# EAGLE design BLDC (EAGLE 8.0.1)
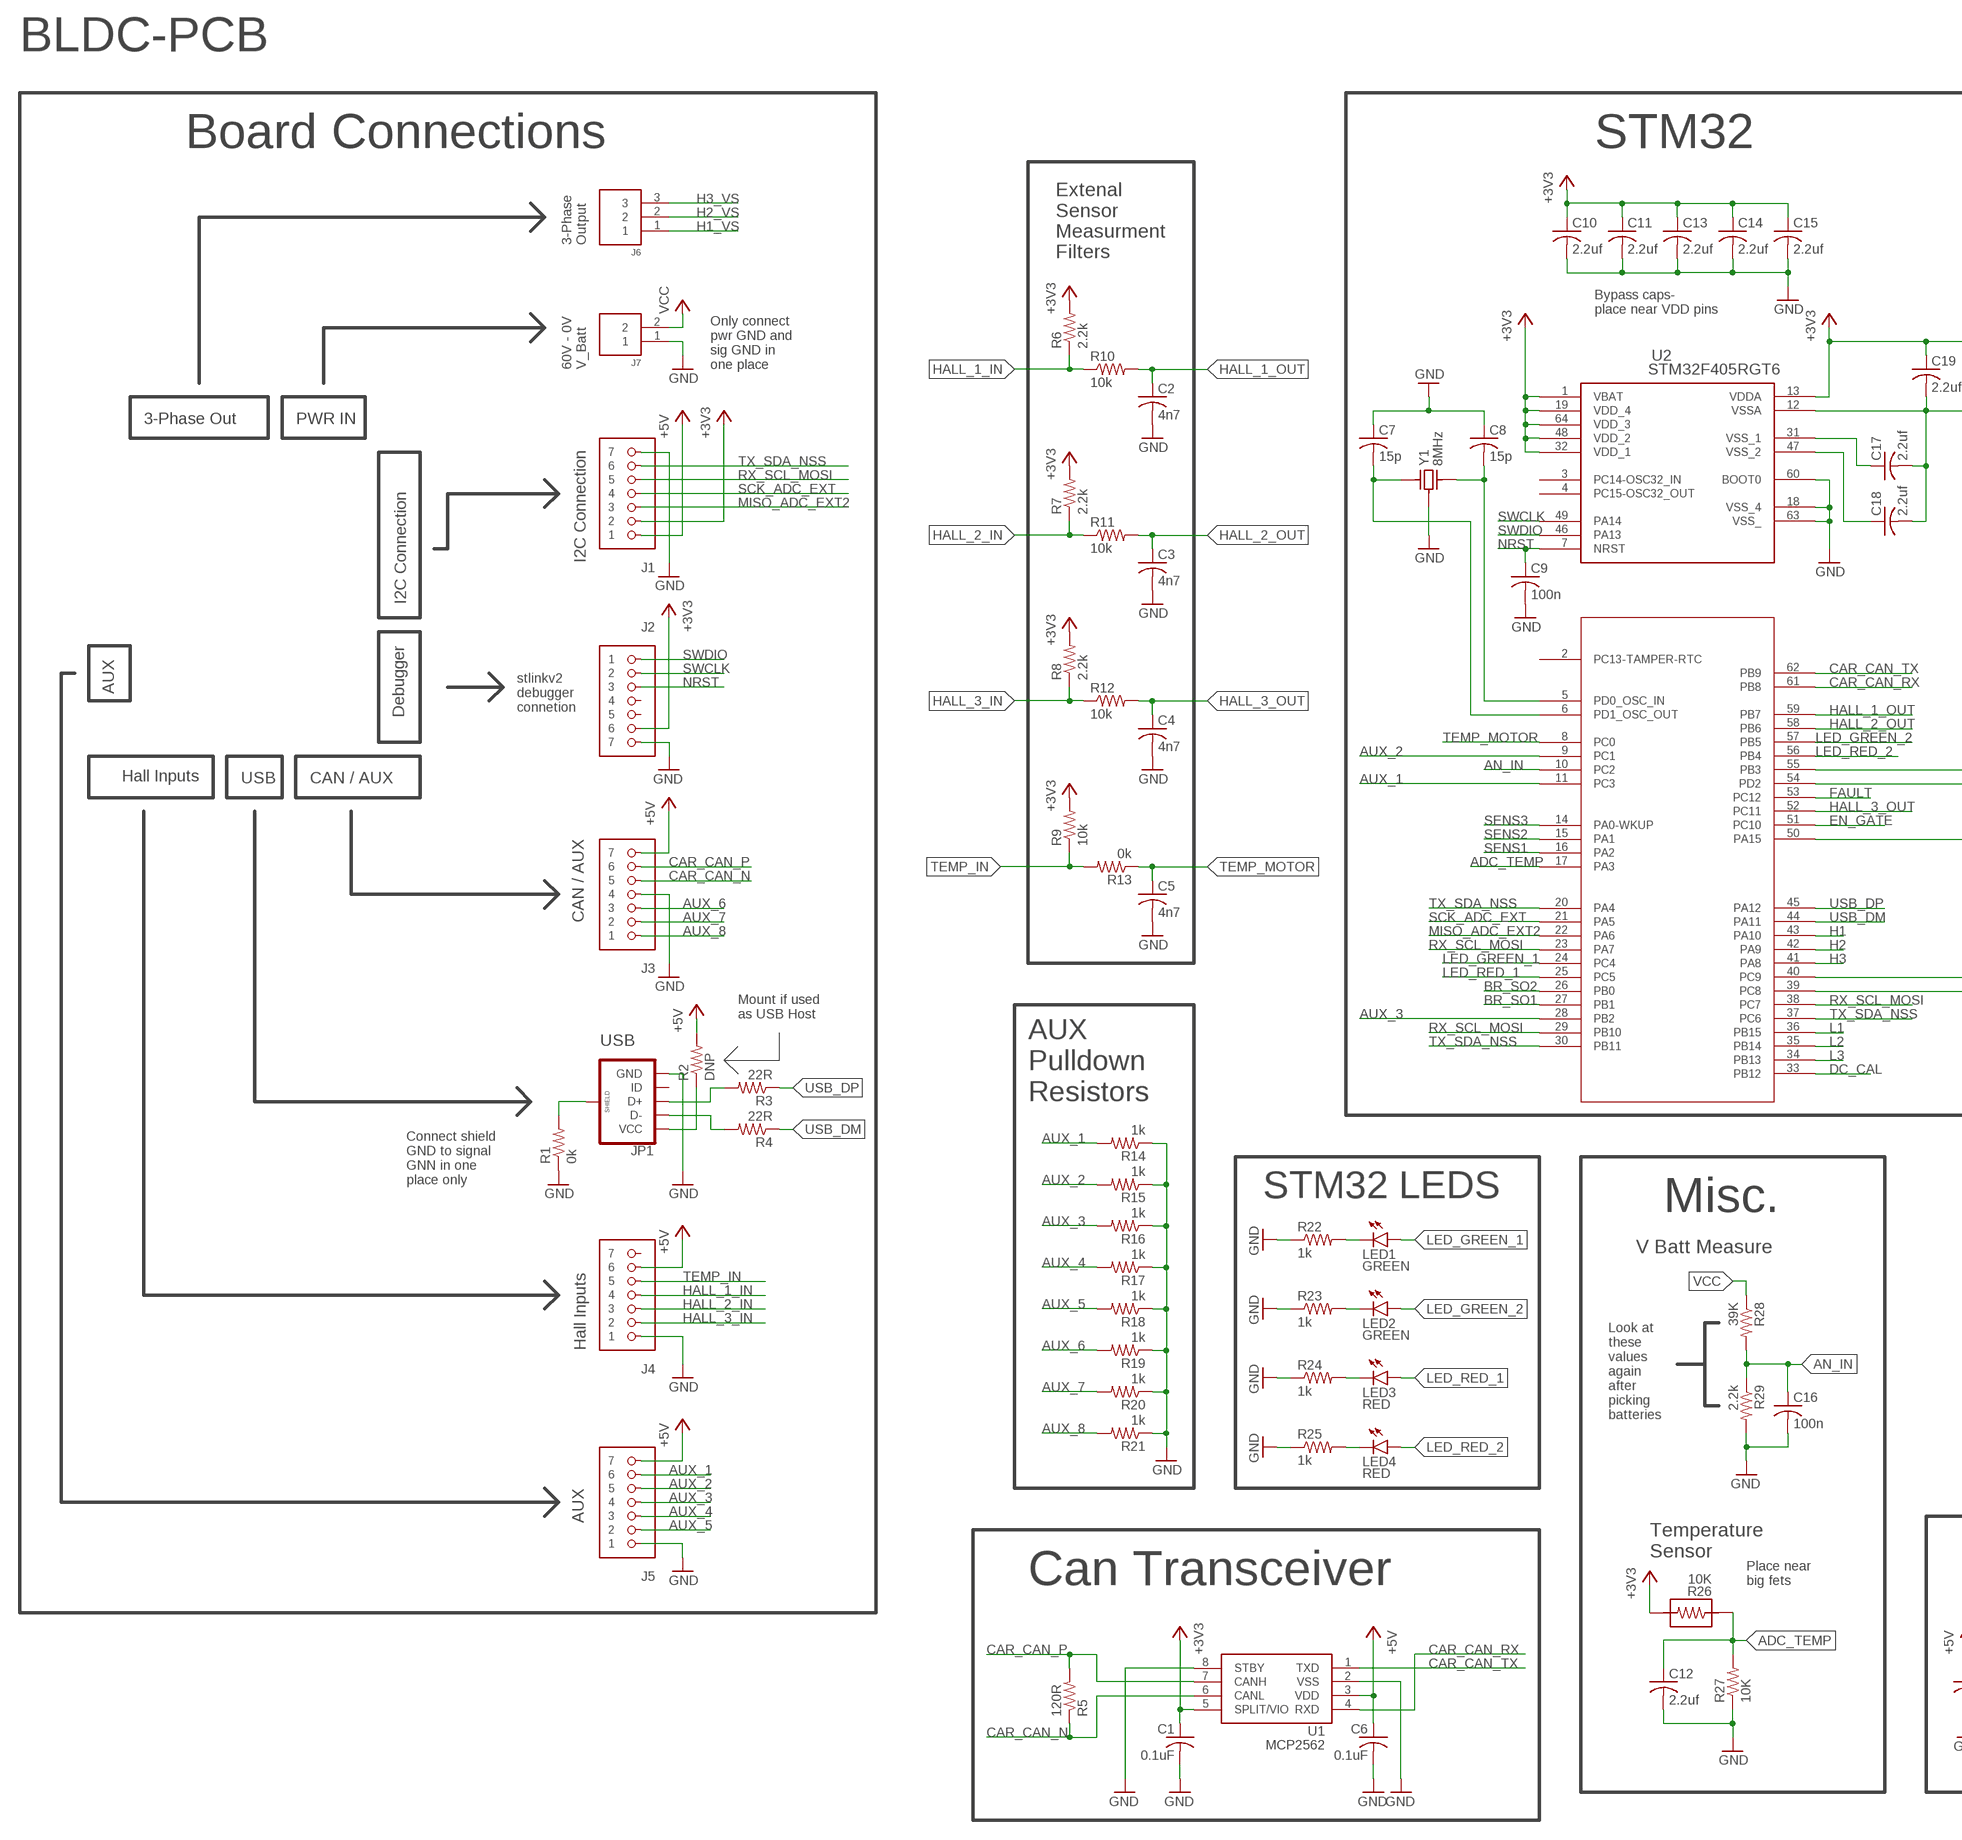
[diagram p0: schematic, sheet 1, part 1 of 2]
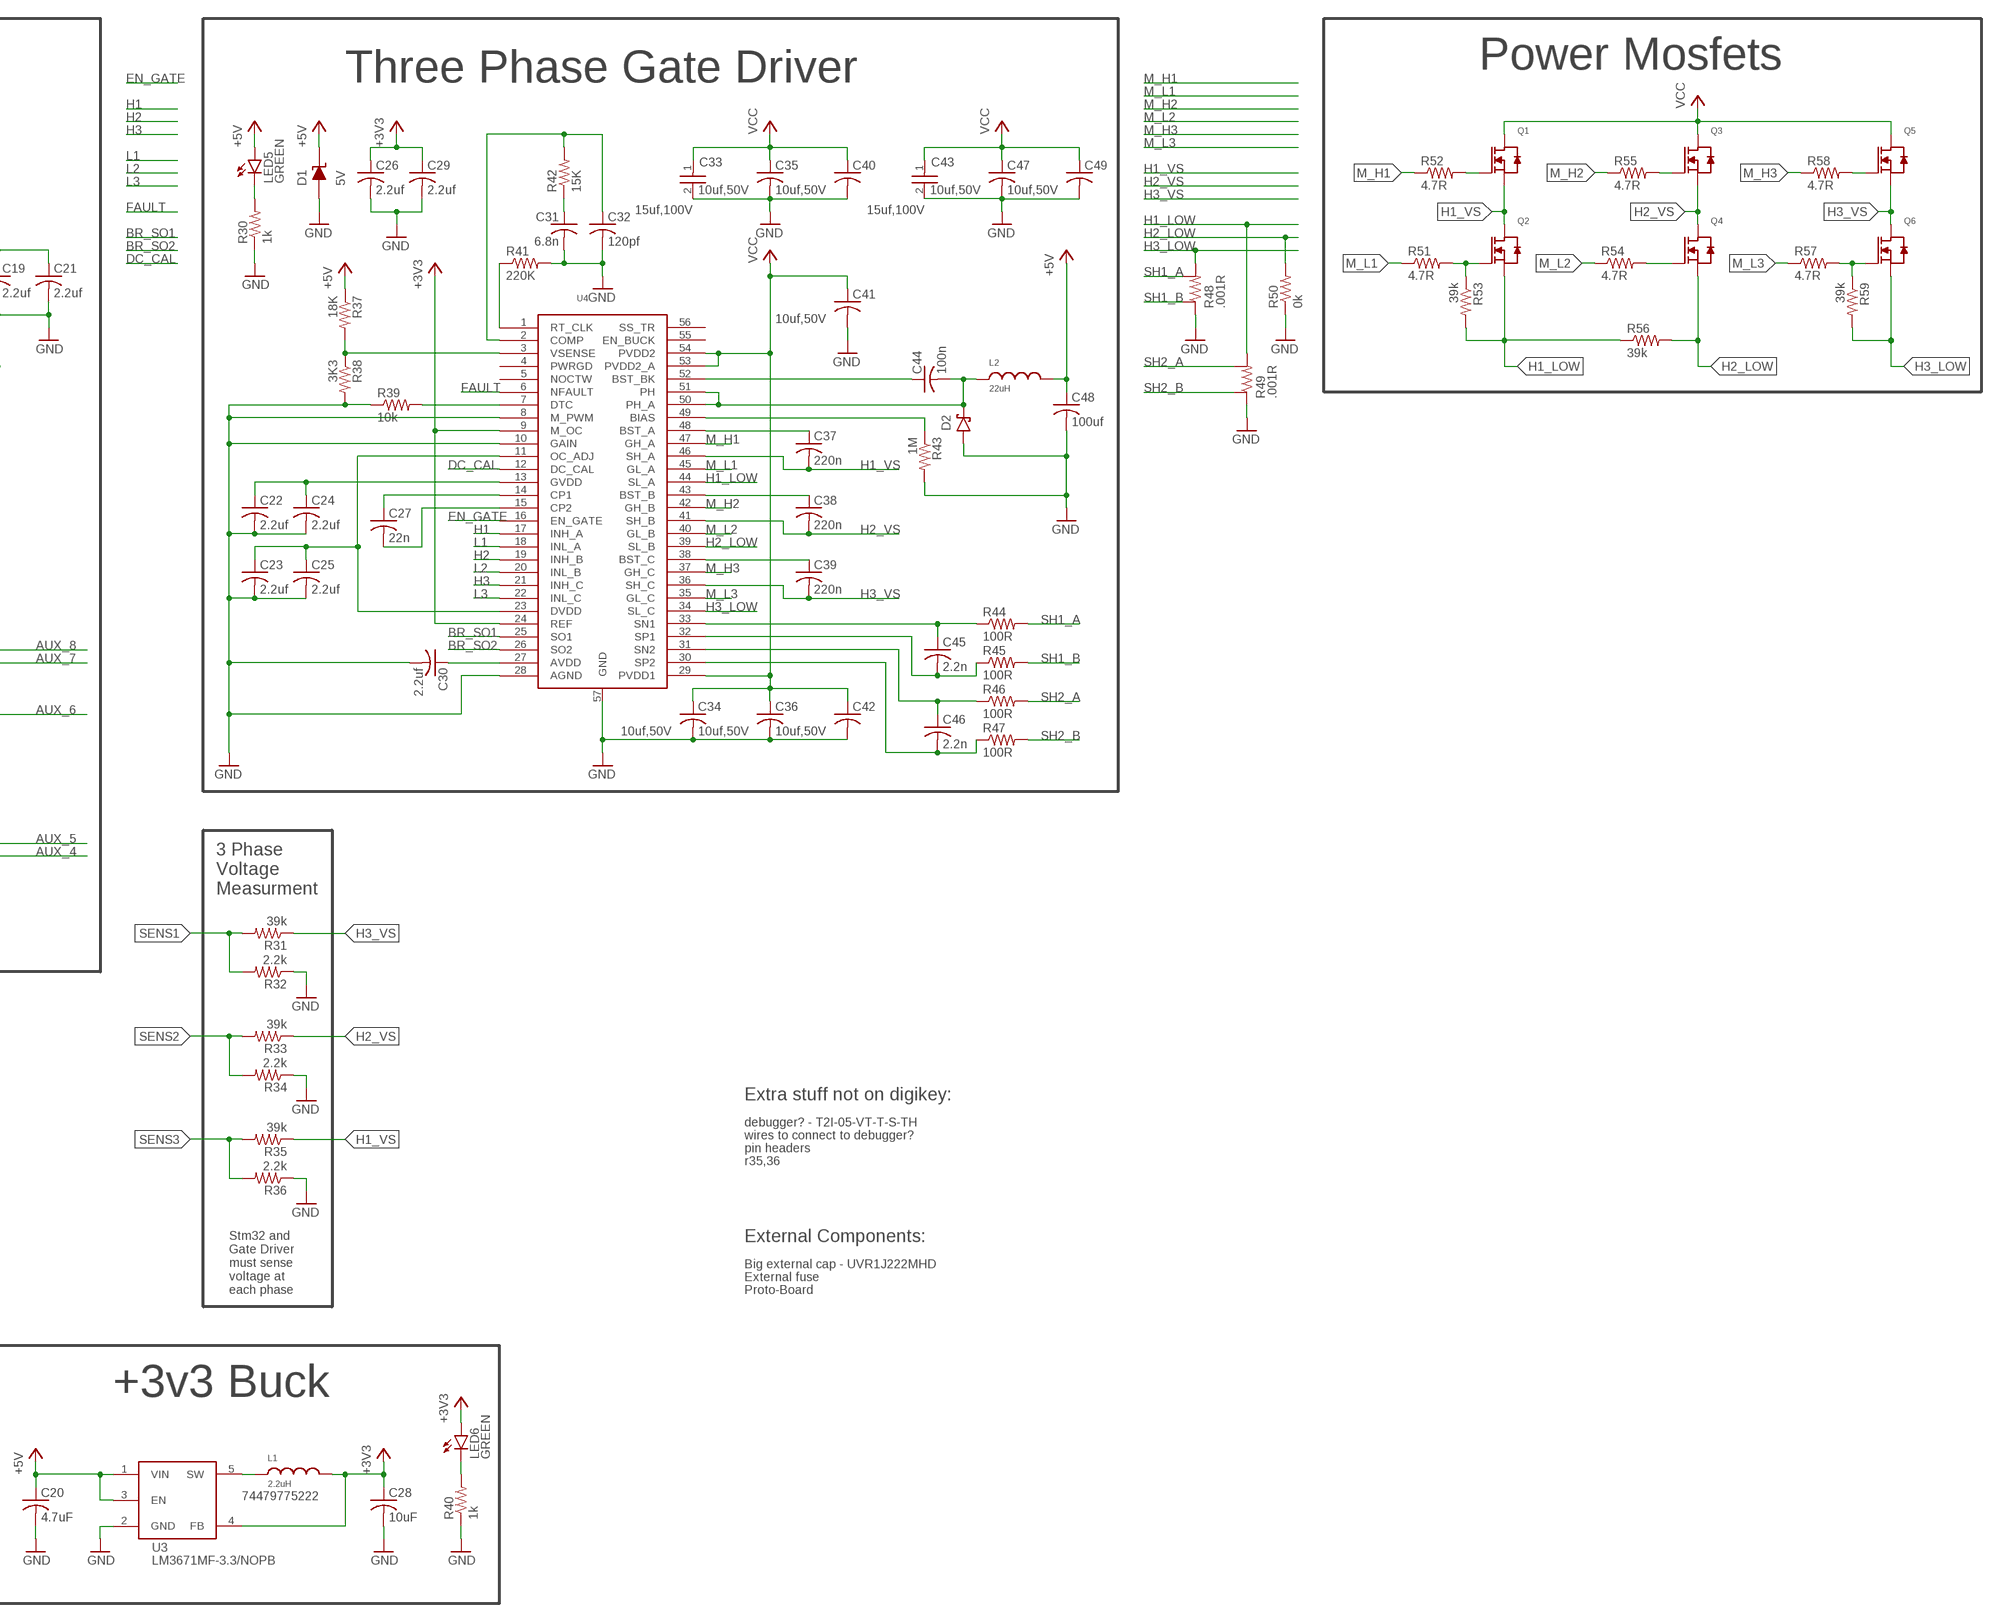
[diagram p1: schematic, sheet 1, part 2 of 2]

## Parts
C1  0.1uF  C-USC0805  [C0805]
C2  4n7  C-USC0805  [C0805]
C3  4n7  C-USC0805  [C0805]
C4  4n7  C-USC0805  [C0805]
C5  4n7  C-USC0805  [C0805]
C6  0.1uF  C-USC0805  [C0805]
C7  15p  C-USC0805  [C0805]
C8  15p  C-USC0805  [C0805]
C9  100n  C-USC0805  [C0805]
C10  2.2uf  C-USC0805  [C0805]
C11  2.2uf  C-USC0805  [C0805]
C12  2.2uf  C-USC0805  [C0805]
C13  2.2uf  C-USC0805  [C0805]
C14  2.2uf  C-USC0805  [C0805]
C15  2.2uf  C-USC0805  [C0805]
C16  100n  C-USC0805  [C0805]
C17  2.2uf  C-USC0805  [C0805]
C18  2.2uf  C-USC0805  [C0805]
C19  2.2uf  C-USC0805  [C0805]
C20  4.7uF  C-USC0805  [C0805]
C21  2.2uf  C-USC0805  [C0805]
C22  2.2uf  C-USC0805  [C0805]
C23  2.2uf  C-USC0805  [C0805]
C24  2.2uf  C-USC0805  [C0805]
C25  2.2uf  C-USC0805  [C0805]
C26  2.2uf  C-USC0805  [C0805]
C27  22n  C-USC0805  [C0805]
C28  10uF  C-USC0805  [C0805]
C29  2.2uf  C-USC0805  [C0805]
C30  2.2uf  C-USC0805  [C0805]
C31  6.8n  C-USC0805  [C0805]
C32  120pf  C-USC0805  [C0805]
C33  15uf,100V  KCM55WR72A156MH01K  [K-55]
C34  10uf,50V  C-USC1206  [C1206]
C35  10uf,50V  C-USC1206  [C1206]
C36  10uf,50V  C-USC1206  [C1206]
C37  220n  C-USC0805  [C0805]
C38  220n  C-USC0805  [C0805]
C39  220n  C-USC0805  [C0805]
C40  10uf,50V  C-USC1206  [C1206]
C41  10uf,50V  C-USC1206  [C1206]
C42  10uf,50V  C-USC1206  [C1206]
C43  15uf,100V  KCM55WR72A156MH01K  [K-55]
C44  100n  C-USC0805  [C0805]
C45  2.2n  C-USC0805  [C0805]
C46  2.2n  C-USC0805  [C0805]
C47  10uf,50V  C-USC1206  [C1206]
C48  100uf  C-USC0805  [C0805]
C49  10uf,50V  C-USC1206  [C1206]
D1  5V  PLVA650A  [SOT-23_DIODE]
D2  CD1206-B260  [1206-DIODE]
J1  JST-1X7-MICRO  [JST-1X7]
J2  JST-1X7-MICRO  [JST-1X7]
J3  JST-1X7-MICRO  [JST-1X7]
J4  JST-1X7-MICRO  [JST-1X7]
J5  JST-1X7-MICRO  [JST-1X7]
J6  IPBT-103-H1-XX-S-RA  [IPBT-103-H1-XX-S-RA]
J7  IPBT-102-H1-XX-S-RA  [IPBT-102-H1-XX-S-RA]
JP1  USB_MICROB_PLUG-PTH3  [MOLEX-MICROUSB-B-105017-0001]
L1  2.2uH  L0805  [0805]
L2  22uH  TYS5040220M-10  [TYS5040220M-10]
LED1  GREEN  LEDCHIP-LED0805  [CHIP-LED0805]
LED2  GREEN  LEDCHIP-LED0805  [CHIP-LED0805]
LED3  RED  5988110107F  [CHIP-LED0805]
LED4  RED  5988110107F  [CHIP-LED0805]
LED5  GREEN  LEDCHIP-LED0805  [CHIP-LED0805]
LED6  GREEN  LEDCHIP-LED0805  [CHIP-LED0805]
Q1  IRFS7530TRLPBF  [D2PAK]
Q2  IRFS7530TRLPBF  [D2PAK]
Q3  IRFS7530TRLPBF  [D2PAK]
Q4  IRFS7530TRLPBF  [D2PAK]
Q5  IRFS7530TRLPBF  [D2PAK]
Q6  IRFS7530TRLPBF  [D2PAK]
R1  0k  R-US_R0805  [R0805]
R2  DNP  R-US_R0805  [R0805]
R3  22R  R-US_R0805  [R0805]
R4  22R  R-US_R0805  [R0805]
R5  120R  R-US_R0805  [R0805]
R6  2.2k  R-US_R0805  [R0805]
R7  2.2k  R-US_R0805  [R0805]
R8  2.2k  R-US_R0805  [R0805]
R9  10k  R-US_R0805  [R0805]
R10  10k  R-US_R0805  [R0805]
R11  10k  R-US_R0805  [R0805]
R12  10k  R-US_R0805  [R0805]
R13  0k  R-US_R0805  [R0805]
R14  1k  R-US_R0805  [R0805]
R15  1k  R-US_R0805  [R0805]
R16  1k  R-US_R0805  [R0805]
R17  1k  R-US_R0805  [R0805]
R18  1k  R-US_R0805  [R0805]
R19  1k  R-US_R0805  [R0805]
R20  1k  R-US_R0805  [R0805]
R21  1k  R-US_R0805  [R0805]
R22  1k  R-US_R0805  [R0805]
R23  1k  R-US_R0805  [R0805]
R24  1k  R-US_R0805  [R0805]
R25  1k  R-US_R0805  [R0805]
R26  10K  NCP18XH103F03RB  [0603]
R27  10K  R-US_R0805  [R0805]
R28  39K  R-US_R0805  [R0805]
R29  2.2k  R-US_R0805  [R0805]
R30  1k  R-US_R0805  [R0805]
R31  39k  R-US_R0805  [R0805]
R32  2.2k  R-US_R0805  [R0805]
R33  39k  R-US_R0805  [R0805]
R34  2.2k  R-US_R0805  [R0805]
R35  39k  R-US_R0805  [R0805]
R36  2.2k  R-US_R0805  [R0805]
R37  18K  R-US_R0805  [R0805]
R38  3K3  R-US_R0805  [R0805]
R39  10k  R-US_R0805  [R0805]
R40  1k  R-US_R0805  [R0805]
R41  220K  R-US_R0805  [R0805]
R42  15K  R-US_R0805  [R0805]
R43  1M  R-US_R0805  [R0805]
R44  100R  R-US_R0805  [R0805]
R45  100R  R-US_R0805  [R0805]
R46  100R  R-US_R0805  [R0805]
R47  100R  R-US_R0805  [R0805]
R48  .001R  WSLP27261L000FEA  [2726]
R49  .001R  WSLP27261L000FEA  [2726]
R50  0k  R-US_R0805  [R0805]
R51  4.7R  R-US_R0805  [R0805]
R52  4.7R  R-US_R0805  [R0805]
R53  39k  R-US_R0805  [R0805]
R54  4.7R  R-US_R0805  [R0805]
R55  4.7R  R-US_R0805  [R0805]
R56  39k  R-US_R0805  [R0805]
R57  4.7R  R-US_R0805  [R0805]
R58  4.7R  R-US_R0805  [R0805]
R59  39k  R-US_R0805  [R0805]
U1  MCP2562  MCP256X-SOIC  [SOIC8-N_MC]
U2  STM32F405RGT6  [LQFP-64]
U3  LM3671MF-3.3/NOPB  LM3671MF  [SOT23-5]
U4  DRV8302  [HTSSOP-56]
Y1  8MHz  ABM3B-8.000MHZ-10-1-U-T  [4-SMD]

## Nets
+3V3: C1.1 C10.1 C11.1 C13.1 C14.1 C15.1 C19.1 C21.1 C26.1 C28.1 C29.1 J1.P$2 J2.P$6 L1.2 LED6.A R6.2 R7.2 R8.2 R9.2 R26.2 U1.5(SPLIT/VIO) U2.1(VBAT) U2.13(VDDA) U2.19(VDD_4) U2.32(VDD_1) U2.48(VDD_2) U2.64(VDD_3) U3.4(FB) U4.9(M_OC) U4.24(REF)
+5V: C6.1 C20.1 C48.1 D1.K(CATHODE) J1.P$1 J3.P$7 J4.P$6 J5.P$7 L2.P$2 LED5.A R2.2 R37.1 U1.3(VDD) U3.1(VIN) U3.3(EN)
ADC_TEMP: C12.1 R26.1 R27.2 U2.17(PA3)
AN_IN: C16.1 R28.2 R29.1 U2.10(PC2)
AUX_1: J5.P$6 R14.2 U2.11(PC3)
AUX_2: J5.P$5 R15.2 U2.9(PC1)
AUX_3: J5.P$4 R16.2 U2.28(PB2)
AUX_4: J5.P$3 R17.2 U2.39(PC8)
AUX_5: J5.P$2 R18.2 U2.40(PC9)
AUX_6: J3.P$3 R19.2 U2.50(PA15)
AUX_7: J3.P$2 R20.2 U2.54(PD2)
AUX_8: J3.P$1 R21.2 U2.55(PB3)
BR_SO1: U2.27(PB1) U4.25(SO1)
BR_SO2: U2.26(PB0) U4.26(SO2)
CAR_CAN_N [diffPairs]: J3.P$5 R5.1 U1.6(CANL)
CAR_CAN_P [diffPairs]: J3.P$6 R5.2 U1.7(CANH)
CAR_CAN_RX: U1.4(RXD) U2.61(PB8)
CAR_CAN_TX: U1.1(TXD) U2.62(PB9)
DC_CAL: U2.33(PB12) U4.12(DC_CAL)
EN_GATE: U2.51(PC10) U4.16(EN_GATE)
FAULT: U2.53(PC12) U4.6(NFAULT)
GND: C1.2 C2.2 C3.2 C4.2 C5.2 C6.2 C7.1 C8.1 C9.2 C10.2 C11.2 C12.2 C13.2 C14.2 C15.2 C16.2 C17.2 C18.2 C19.2 C20.2 C21.2 C22.2 C23.2 C24.2 C25.2 C26.2 C28.2 C29.2 C30.2 C31.2 C32.2 C33.2(-) C34.2 C35.2 C36.2 C40.2 C41.2 C42.2 C43.2(-) C47.2 C48.2 C49.2 D1.A(ANODE) D2.A J1.P$7 J2.P$7 J3.P$4 J4.P$1 J5.P$1 J7.1 JP1.5(GND) JP1.P$5(GND) R1.1 R14.1 R15.1 R16.1 R17.1 R18.1 R19.1 R20.1 R21.1 R22.1 R23.1 R24.1 R25.1 R27.1 R29.2 R30.1 R32.1 R34.1 R36.1 R38.2 R39.1 R40.1 R41.2 R43.2 R48.BL R49.BL R50.1 U1.2(VSS) U1.8(STBY) U2.12(VSSA) U2.18(VSS_4) U2.60(BOOT0) U2.63(VSS_) U3.2(GND) U4.8(M_PWM) U4.10(GAIN) U4.28(AGND) U4.57(GND) Y1.2(GND) Y1.4(GND)
H1: U2.43(PA10) U4.17(INH_A)
H1_LOW: Q2.A2(S) R49.BR R53.2 R56.1 U4.44(SL_A)
H1_VS: C37.2 J6.1 Q1.A2(S) Q2.K(D) R35.1 U4.46(SH_A)
H2: U2.42(PA9) U4.19(INH_B)
H2_LOW: Q4.A2(S) R50.2 R56.2 U4.39(SL_B)
H2_VS: C38.2 J6.2 Q3.A2(S) Q4.K(D) R33.1 U4.41(SH_B)
H3: U2.41(PA8) U4.21(INH_C)
H3_LOW: Q6.A2(S) R48.BR R59.2 U4.34(SL_C)
H3_VS: C39.2 J6.3 Q5.A2(S) Q6.K(D) R31.1 U4.36(SH_C)
HALL_1_IN: J4.P$4 R6.1 R10.1
HALL_1_OUT: C2.1 R10.2 U2.59(PB7)
HALL_2_IN: J4.P$3 R7.1 R11.1
HALL_2_OUT: C3.1 R11.2 U2.58(PB6)
HALL_3_IN: J4.P$2 R8.1 R12.1
HALL_3_OUT: C4.1 R12.2 U2.52(PC11)
L1: U2.36(PB15) U4.18(INL_A)
L2: U2.35(PB14) U4.20(INL_B)
L3: U2.34(PB13) U4.22(INL_C)
LED_GREEN_1: LED1.A U2.24(PC4)
LED_GREEN_2: LED2.A U2.57(PB5)
LED_RED_1: LED3.A U2.25(PC5)
LED_RED_2: LED4.A U2.56(PB4)
M_H1: R52.1 U4.47(GH_A)
M_H2: R55.1 U4.42(GH_B)
M_H3: R58.1 U4.37(GH_C)
M_L1: R51.1 U4.45(GL_A)
M_L2: R54.1 U4.40(GL_B)
M_L3: R57.1 U4.35(GL_C)
MISO_ADC_EXT2: J1.P$3 U2.22(PA6)
N$1: LED3.C R24.2
N$2: LED2.C R23.2
N$3: JP1.2(D-) JP1.P$2(D-) R4.2
N$4: JP1.3(D+) JP1.P$3(D+) R3.2
N$5: JP1.1(VCC) JP1.P$1(VCC) R2.1
N$6: C18.1 U2.47(VSS_2)
N$7: C8.2 U2.5(PD0_OSC_IN) Y1.3
N$8: C7.2 U2.6(PD1_OSC_OUT) Y1.1
N$9: R41.1 U4.1(RT_CLK)
N$10: C31.1 R42.1
N$11: L1.1 U3.5(SW)
N$12: C32.1 R42.2 U4.2(COMP)
N$13: R37.2 R38.1 U4.3(VSENSE)
N$14: R39.2 U4.7(DTC)
N$15: C23.1 C25.1 U4.11(OC_ADJ) U4.23(DVDD)
N$16: C22.1 C24.1 U4.13(GVDD)
N$17: C27.1 U4.14(CP1)
N$18: C30.1 U4.27(AVDD)
N$19: C27.2 U4.15(CP2)
N$20: C44.1 U4.52(BST_BK)
N$21: C44.2 D2.C(K) L2.P$1 U4.50(PH_A) U4.51(PH)
N$22: R43.1 U4.49(BIAS)
N$23: C37.1 U4.48(BST_A)
N$24: C45.1 R44.1 U4.33(SN1)
N$25: C38.1 U4.43(BST_B)
N$26: C45.2 R45.1 U4.32(SP1)
N$27: C39.1 U4.38(BST_C)
N$28: C46.2 R47.1 U4.30(SP2)
N$29: C46.1 R46.1 U4.31(SN2)
N$30: Q1.A1(G) R52.2
N$31: Q3.A1(G) R55.2
N$32: Q5.A1(G) R58.2
N$33: Q2.A1(G) R51.2 R53.1
N$34: Q4.A1(G) R54.2
N$35: Q6.A1(G) R57.2 R59.1
N$37: C17.1 U2.31(VSS_1)
N$38: LED1.C R22.2
N$39: LED4.C R25.2
N$40: LED5.C R30.2
N$81: LED6.C R40.2
NRST: C9.1 J2.P$3 U2.7(NRST)
RX_SCL_MOSI: J1.P$5 U2.23(PA7) U2.29(PB10) U2.38(PC7)
SCK_ADC_EXT: J1.P$4 U2.21(PA5)
SENS1: R31.2 R32.2 U2.16(PA2)
SENS2: R33.2 R34.2 U2.15(PA1)
SENS3: R35.2 R36.2 U2.14(PA0-WKUP)
SGND: JP1.P$6(SHIELD) JP1.P$7(SHIELD) JP1.P$8(SHIELD) JP1.P$9(SHIELD) R1.2
SH1_A: R44.2 R48.TR
SH1_B: R45.2 R48.TL
SH2_A: R46.2 R49.TR
SH2_B: R47.2 R49.TL
SWCLK: J2.P$2 U2.49(PA14)
SWDIO: J2.P$1 U2.46(PA13)
TEMP_IN: J4.P$5 R9.1 R13.2
TEMP_MOTOR: C5.1 R13.1 U2.8(PC0)
TX_SDA_NSS: J1.P$6 U2.20(PA4) U2.30(PB11) U2.37(PC6)
USB_DM: R4.1 U2.44(PA11)
USB_DP: R3.1 U2.45(PA12)
VCC: C33.1(+) C34.1 C35.1 C36.1 C40.1 C41.1 C42.1 C43.1(+) C47.1 C49.1 J7.2 Q1.K(D) Q3.K(D) Q5.K(D) R28.1 U4.29(PVDD1) U4.53(PVDD2_A) U4.54(PVDD2)
Unconnected: J2.P$4 J2.P$5 J4.P$7 JP1.4(ID) JP1.P$4(ID) U2.2(PC13-TAMPER-RTC) U2.3(PC14-OSC32_IN) U2.4(PC15-OSC32_OUT) U4.4(PWRGD) U4.5(NOCTW) U4.55(EN_BUCK) U4.56(SS_TR)

## Notes on the sheet
- BLDC-PCB
- Board Connections | STM32 | Three Phase Gate Driver | Power Mosfets
- 3-Phase
  Output
- Extenal 
  Sensor
  Measurment 
  Filters
- Bypass caps- 
  place near VDD pins
- 60V - 0V
  V_Batt
- Only connect 
  pwr GND and 
  sig GND in 
  one place
- 3-Phase Out | PWR IN
- I2C Connection
- I2C Connection
- Debugger
- AUX
- stlinkv2 
  debugger
  connetion
- Hall Inputs
- USB | CAN / AUX
- CAN / AUX
- Mount if used 
  as USB Host
- 3 Phase 
  Voltage
  Measurment
- USB
- AUX
  Pulldown
  Resistors
- Connect shield
  GND to signal
  GNN in one 
  place only
- STM32 LEDS
- Misc.
- V Batt Measure | Extra stuff not on digikey:
- debugger? - T2I-05-VT-T-S-TH
- wires to connect to debugger?
- pin headers
- r35,36
- Hall Inputs
- External Components:
- Look at 
  these 
  values 
  again 
  after 
  picking 
  batteries
- Big external cap - UVR1J222MHD
- External fuse
- Stm32 and 
  Gate Driver 
  must sense 
  voltage at 
  each phase
- Proto-Board
- AUX
- Temperature
  Sensor
- Can Transceiver | +3v3 Buck
- Place near 
  big fets
- 74479775222

## Library data of the parts
C1 C6 = rcl:C-US: CAPACITOR, American symbol; PARTNO: GRM21BR71E104KA01L
C2-C5 = rcl:C-US: CAPACITOR, American symbol; PARTNO: GRM2165C1H472FA01D
C7 C8 = rcl:C-US: CAPACITOR, American symbol; PARTNO: CL21C150JBANNNC
C9 C16 C44 = rcl:C-US: CAPACITOR, American symbol; PARTNO: 08053C104KAT2A
C10-C15 C17-C19 C21-C26 C29 C30 = rcl:C-US: CAPACITOR, American symbol; PARTNO: UMK212BB7225KG-T
C20 = rcl:C-US: CAPACITOR, American symbol; PARTNO: GRM21BR61E475KA12L
C27 = rcl:C-US: CAPACITOR, American symbol; PARTNO: C2012C0G1H223J125AA
C28 = rcl:C-US: CAPACITOR, American symbol; PARTNO: TMK212BBJ106KG-T
C31 = rcl:C-US: CAPACITOR, American symbol; PARTNO: C0805C682K5RACTU
C32 = rcl:C-US: CAPACITOR, American symbol; PARTNO: 08051A121FAT2A
C33 C43 = FormE:KCM55WR72A156MH01K; MANUFACTURER_PART_NUMBER: KCM55WR72A156MH01K; PARTNO: KCM55WR72A156MH01K; VENDOR: Murata
C34-C36 C40-C42 C47 C49 = rcl:C-US: CAPACITOR, American symbol; PARTNO: C3216JB1H106K160AB
C37-C39 = rcl:C-US: CAPACITOR, American symbol; PARTNO: GRM219R71C224KA01D
C45 C46 = rcl:C-US: CAPACITOR, American symbol; PARTNO: C2012C0G1H222J060AA
C48 = rcl:C-US: CAPACITOR, American symbol; PARTNO: GRM21BR60G107ME15L
D1 = FormE:PLVA650A: Zener Diode 5V; PARTNO: SMF5.0A; VALUE: 568-6471-1-ND
D2 = FormE:CD1206-B260: 60V 2A Schottky Diode; PARTNO: CD1206-B260
J1-J5 = FormE:JST-1X7-MICRO: 2.00 mm pitch board-cable connector
J6 = FormE:IPBT-103-H1-XX-S-RA: .165 pitch 1X3 right angle brd-cable connector
J7 = FormE:IPBT-102-H1-XX-S-RA: .165 pitch 1X2 right angle brd-cable connector
JP1 = FormE:USB_MICROB_PLUG: USB Micro-B connectors Some male, some female. Watch your step!
L1 = FormE:L0805; PARTNO: 74479775222
L2 = FormE:TYS5040220M-10: 22uH 1.5A inductor; PARTNO: TYS5040220M-10
LED1 LED2 LED5 LED6 = FormE:LED: LED OSRAM: - CHIPLED LG R971, LG N971, LY N971, LG Q971, LY Q971, LO R971, LY R971 LH N974, LH R974 LS Q976, LO Q976, LY Q976 LO Q996 - Hyper CHIPLED LW Q18S LB Q993, LB Q99A, LB R99A - SideLED LS A670, LO A670, LY A670, LG A670, LP A670 LB A673, LV A673, LT A673, LW A673 LH A674 LY A675 LS A676, LA A676, LO A676, LY A676, LW A676 LS A679, LY A679, LG A679 - Hyper Micro SIDELED® LS Y876, LA Y876, LO Y876, LY Y876 LT Y87S - SmartLED LW L88C, LW L88S LB L89C, LB L89S, LG L890 LS L89K, LO L89K, LY L89K LS L896, LA L896, LO L896, LY L896 - TOPLED LS T670, LO T670, LY T670, LG T670, LP T670 LSG T670, LSP T670, LSY T670, LOP T670, LYG T670 LG T671, LOG T671, LSG T671 LB T673, LV T673, LT T673, LW T673 LH T674 LS T676, LA T676, LO T676, LY T676, LB T676, LH T676, LSB T676, LW T676 LB T67C, LV T67C, LT T67C, LS T67K, LO T67K, LY T67K, LW E67C LS E67B, LA E67B, LO E67B, LY E67B, LB E67C, LV E67C, LT E67C LW T67C LS T679, LY T679, LG T679 LS T770, LO T770, LY T770, LG T770, LP T770 LB T773, LV T773, LT T773, LW T773 LH T774 LS E675, LA E675, LY E675, LS T675 LS T776, LA T776, LO T776, LY T776, LB T776 LHGB T686 LT T68C, LB T68C - Hyper Mini TOPLED® LB M676 - Mini TOPLED Santana® LG M470 LS M47K, LO M47K, LY M47K Source: http://www.osram.convergy.de/; PARTNO: 598-8170-107F
LED3 LED4 = FormE:5988110107F: Red LED; PARTNO: 5988110107F
Q1-Q6 = FormE:IRFS7530TRLPBF: 60v 195a N-Channel Mosfet; PARTNO: IRFS7530TRLPBF
R1 R2 R13 R50 = adafruit:R-US_: RESISTOR, American symbol; PARTNO: ERJ-6GEY0R00V
R3 R4 = adafruit:R-US_: RESISTOR, American symbol; PARTNO: RMCF0805FT22R0
R5 = rcl:R-US_: RESISTOR, American symbol; PARTNO: ERJ-6ENF1200V
R6-R8 R29 R32 R34 R36 = adafruit:R-US_: RESISTOR, American symbol; PARTNO: RMCF0805FT2K20
R9-R12 R27 R39 = adafruit:R-US_: RESISTOR, American symbol; PARTNO: ERJ-6ENF1002V
R14-R25 R30 R40 = adafruit:R-US_: RESISTOR, American symbol; PARTNO: RMCF0805FT1K00
R26 = FormE:NCP18XH103F03RB: 10K Thermistor; NCP18XH103F03RB: 10K; PARTNO: NCP18XH103F03RB
R28 R31 R33 R35 R53 R56 R59 = adafruit:R-US_: RESISTOR, American symbol; PARTNO: ERJ-6ENF3902V
R37 = adafruit:R-US_: RESISTOR, American symbol; PARTNO: ERJ-6ENF1802V
R38 = adafruit:R-US_: RESISTOR, American symbol; PARTNO: RMCF0805FT3K30
R41 = adafruit:R-US_: RESISTOR, American symbol; PARTNO: ERJ-6ENF2203V
R42 = adafruit:R-US_: RESISTOR, American symbol; PARTNO: RMCF0805FT15K0
R43 = adafruit:R-US_: RESISTOR, American symbol; PARTNO: ERJ-6ENF1004V
R44-R47 = adafruit:R-US_: RESISTOR, American symbol; PARTNO: ERJ-6ENF1000V
R48 R49 = FormE:WSLP27261L000FEA: 7W, 0.001 Ohm, 4-Lead, Res
R51 R52 R54 R55 R57 R58 = adafruit:R-US_: RESISTOR, American symbol; PARTNO: ERJ-6RQF4R7V
U1 = FormE:MCP256X: MCP2561/2 CAN Transceiver Microchip High-Speed CAN Transceiver Datasheet <http://ww1.microchip.com/downloads/en/DeviceDoc/20005167C.pdf>; PARTNO: MCP2562FD-E/SN
U2 = FormE:STM32F405RGT6; CONNECTIVITY: CAN I²C IrDA LIN SPI UARTUSART USB; COPYRIGHT: Copyright C 2015 Accelerated Designs. All rights reserved; COREPROCESSOR: ARM® Cortex™M3; CORESIZE: 32Bit; DATACONVERTERS: AD 16x12b DA 2x12b; DATASHEET: httpwww.st.cominternetcomTECHNICAL_RESOURCESTECHNICAL_LITERATUREDATASHEETCD00191185.pdf; DIGIKEYPARTNUMBER: 4976444ND; MANUFACTURER_PART_NUMBER: STM32F103RET6; NUMBEROFIO: 51; OPERATINGTEMPERATURE: 40°C ~ 85°C; OSCILLATORTYPE: Internal; PACKAGECASE: 64LQFP; PACKAGING: Tray; PERIPHERALS: DMA Motor Control PWM PDR POR PVD PWM Temp Sensor WDT; PROGRAMMEMORYSIZE: 512KB 512K x 8; PROGRAMMEMORYTYPE: FLASH; QUANTITY_AVAILABLE: 3884; RAMSIZE: 64K x 8; SPEED: 72MHz; VENDOR: ST Microelectronics; VOLTAGESUPPLYVCCVDD: 2 V ~ 3.6 V
U3 = FormE:LM3671; PARTNO: LM3671MF-3.3/NOPB
U4 = FormE:DRV8302; PARTNO: DRV8302DCA
Y1 = FormE:ABM3B-8.000MHZ-10-1-U-T: 8MHz 10ppm Crystal; PARTNO: ABM3B-8.000MHZ-10-1-U-T

## Net classes
1 diffPairs: width 0.254 mm, drill 0.5 mm, clearance 0.254 mm
3 USB: width 0.254 mm, clearance 0.254 mm

## Board
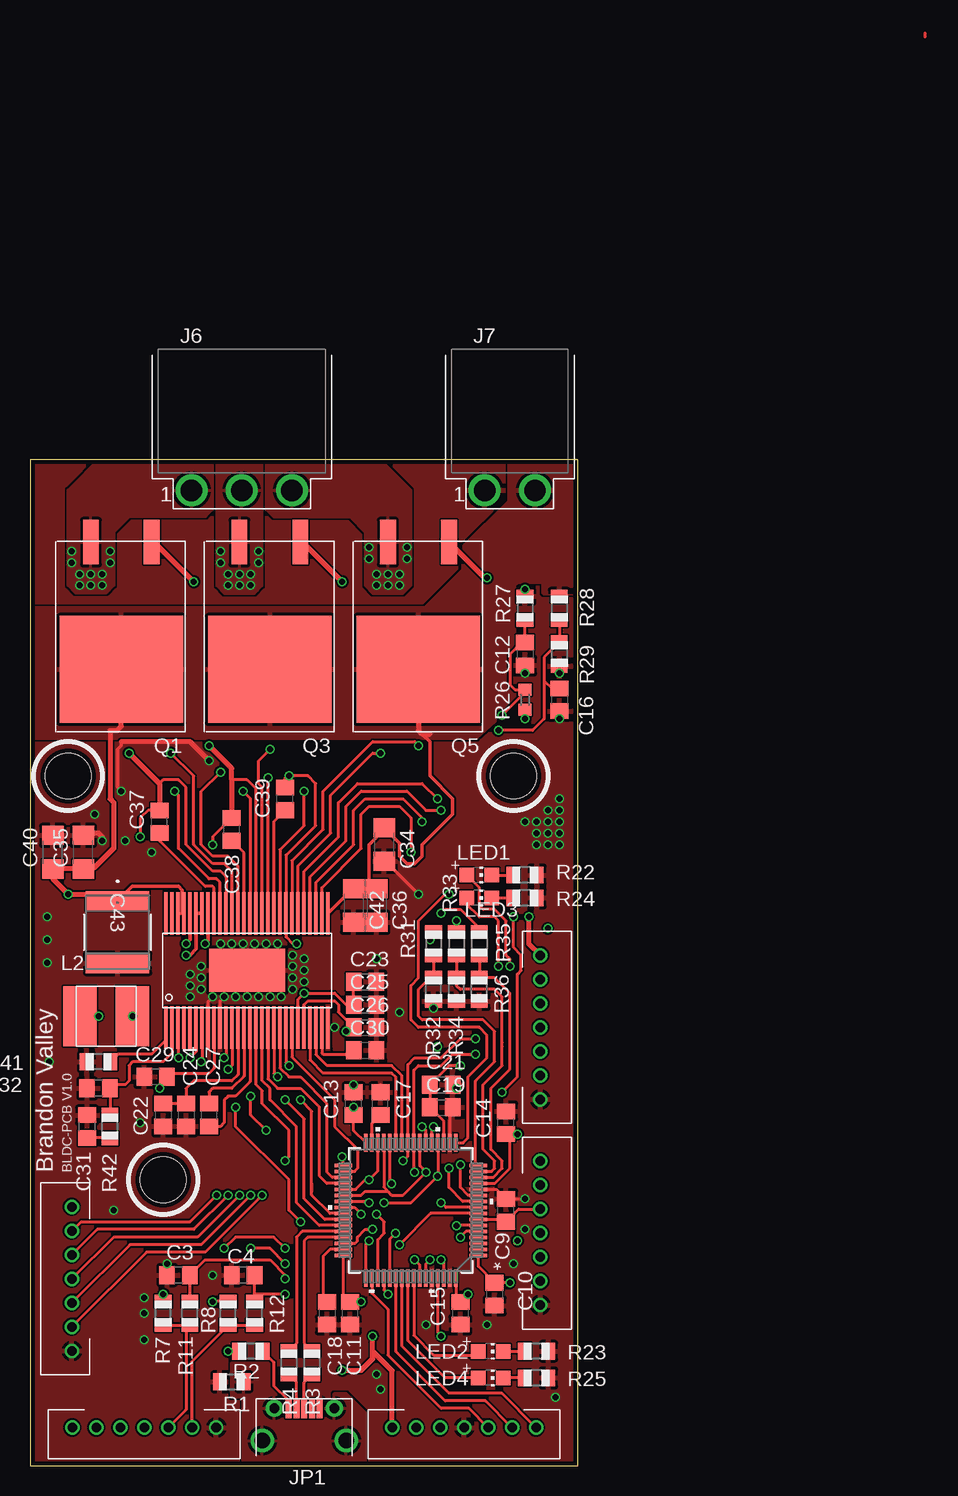
[diagram p2: board, top side]
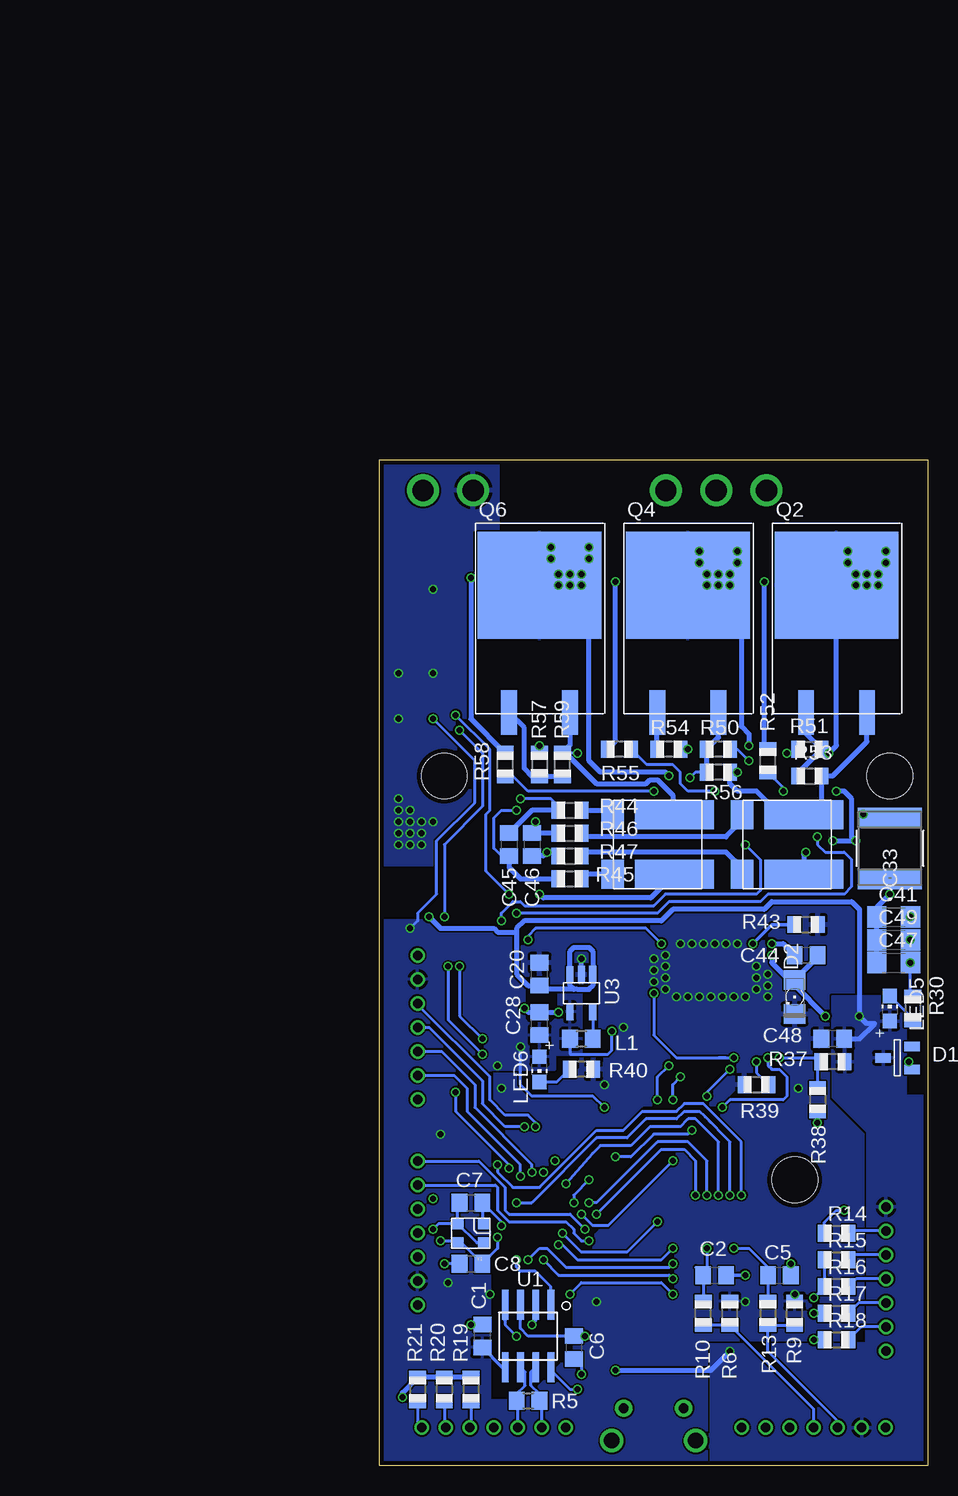
[diagram p3: board, bottom side, seen from below]

Size 45.71 x 83.81 mm. Coordinates in mm from the lower left corner, seen from the top.
Outline: 0,0 45.71,0 45.71,83.81 0,83.81 0,0
Copper layers (1*16): Top 0.0356mm / dielectric 1.5011mm / Bottom 0.0356mm
Design rules "OSH_PCB Rules *": minimum track width 6mil, minimum drill 13mil, track to track 6mil, track to pad 6mil, pad to pad 6mil, via to via 6mil, smd to smd 6mil, copper to edge 15mil, drill to drill 6mil, minimum pad ring 4mil, minimum via ring 4mil, stop-mask expansion 3mil, vias tented up to drill 0mil, thermal gap 10mil
Holes 3.81 mm at 11.11,23.81 3.17,57.47 40.32,57.47

### Footprints (pad centres in the part's own frame; a part is rotated, then mirrored left to right if it is on the bottom)
C0805 = smd 1.3 x 1.5: 1 -0.95,0; 2 0.95,0
K-55 = smd 1.626 x 5.309: 1 -2.591,0; 2 2.591,0
C1206 = smd 1.6 x 1.8: 1 -1.4,0; 2 1.4,0
SOT-23_DIODE = smd 0.8 x 1.3: A -0.95,-1.2; K 0,1.2; NC 0.95,-1.2
1206-DIODE = smd 1.6 x 1.803: A 1.422,0; C -1.422,0
JST-1X7 = drill 0.8: P$1 -6,0; P$2 -4,0; P$3 -2,0; P$4 0,0; P$5 2,0; P$6 4,0; P$7 6,0
IPBT-103-H1-XX-S-RA = drill 1.778 pad 2.54: 1 -2.095,0.94; 2 2.095,0.94; 3 6.287,0.94
IPBT-102-H1-XX-S-RA = drill 1.778 pad 2.54: 1 -2.095,-11.76; 2 2.095,-11.76
MOLEX-MICROUSB-B-105017-0001 = smd 0.5 x 1.6: 1 -1.3,2.853; 2 -0.65,2.853; 3 0,2.853; 4 0.65,2.853; 5 1.3,2.853 | smd 0.2 x 1.15: P$1 -1.3,2.853; P$2 -0.65,2.853; P$3 0,2.853; P$4 0.65,2.853; P$5 1.3,2.853 | drill 0.8 pad 1.45: P$6 -2.5,2.878; P$7 2.5,2.878 | drill 1.3 pad 1.9: P$8 -3.5,0.178; P$9 3.5,0.178
0805 = smd 1.3 x 1.5: 1 -0.95,0; 2 0.95,0
TYS5040220M-10 = smd 2.8 x 5: P$1 2.2,0; P$2 -2.2,0
CHIP-LED0805 = smd 1.2 x 1.2: A 0,-1.05; C 0,1.05
D2PAK = smd 1.321 x 3.708: A1 -2.54,-6.15; A2 2.54,-6.15 | smd 10.312 x 8.915: K 0,4.458
R0805 = smd 1.1 x 1.4: 1 -1,0; 2 1,0
R0805' = smd 1.3 x 1.5: 1 -0.95,0; 2 0.95,0
0603 = smd 1 x 1.1: 1 -0.85,0; 2 0.85,0
2726 = smd 2.44 x 6.6: BL -2.48,-3.3; BR 2.48,-3.3 | smd 2.44 x 1.89: TL -2.48,1.835; TR 2.48,1.835
SOIC8-N_MC = smd 2.5 x 0.559: 1 -2.6,1.905; 2 -2.6,0.635; 3 -2.6,-0.635; 4 -2.6,-1.905; 5 2.6,-1.905; 6 2.6,-0.635; 7 2.6,0.635; 8 2.6,1.905
LQFP-64 = smd 1.473 x 0.279: 1 -5.626,3.75; 2 -5.626,3.25; 3 -5.626,2.75; 4 -5.626,2.25; 5 -5.626,1.75; 6 -5.626,1.25; 7 -5.626,0.75; 8 -5.626,0.25; 9 -5.626,-0.25; 10 -5.626,-0.75; 11 -5.626,-1.25; 12 -5.626,-1.75; 13 -5.626,-2.25; 14 -5.626,-2.75; 15 -5.626,-3.25; 16 -5.626,-3.75; 33 5.626,-3.75; 34 5.626,-3.25; 35 5.626,-2.75; 36 5.626,-2.25; 37 5.626,-1.75; 38 5.626,-1.25; 39 5.626,-0.75; 40 5.626,-0.25; 41 5.626,0.25; 42 5.626,0.75; 43 5.626,1.25; 44 5.626,1.75; 45 5.626,2.25; 46 5.626,2.75; 47 5.626,3.25; 48 5.626,3.75 | smd 0.279 x 1.473: 17 -3.75,-5.626; 18 -3.25,-5.626; 19 -2.75,-5.626; 20 -2.25,-5.626; 21 -1.75,-5.626; 22 -1.25,-5.626; 23 -0.75,-5.626; 24 -0.25,-5.626; 25 0.25,-5.626; 26 0.75,-5.626; 27 1.25,-5.626; 28 1.75,-5.626; 29 2.25,-5.626; 30 2.75,-5.626; 31 3.25,-5.626; 32 3.75,-5.626; 49 3.75,5.626; 50 3.25,5.626; 51 2.75,5.626; 52 2.25,5.626; 53 1.75,5.626; 54 1.25,5.626; 55 0.75,5.626; 56 0.25,5.626; 57 -0.25,5.626; 58 -0.75,5.626; 59 -1.25,5.626; 60 -1.75,5.626; 61 -2.25,5.626; 62 -2.75,5.626; 63 -3.25,5.626; 64 -3.75,5.626
SOT23-5 = smd 0.6 x 1.45: 1 -0.95,-1.55; 2 0,-1.55; 4 0.95,1.55; 5 -0.95,1.55 | smd 0.6 x 1.4: 3 0.95,-1.55
HTSSOP-56 = smd 0.3 x 3.55: 1 -6.75,-4.75; 2 -6.25,-4.75; 3 -5.75,-4.75; 4 -5.25,-4.75; 5 -4.75,-4.75; 6 -4.25,-4.75; 7 -3.75,-4.75; 8 -3.25,-4.75; 9 -2.75,-4.75; 10 -2.25,-4.75; 11 -1.75,-4.75; 12 -1.25,-4.75; 13 -0.75,-4.75; 14 -0.25,-4.75; 15 0.25,-4.75; 16 0.75,-4.75; 17 1.25,-4.75; 18 1.75,-4.75; 19 2.25,-4.75; 20 2.75,-4.75; 21 3.25,-4.75; 22 3.75,-4.75; 23 4.25,-4.75; 24 4.75,-4.75; 25 5.25,-4.75; 26 5.75,-4.75; 27 6.25,-4.75; 28 6.75,-4.75; 29 6.75,4.75; 30 6.25,4.75; 31 5.75,4.75; 32 5.25,4.75; 33 4.75,4.75; 34 4.25,4.75; 35 3.75,4.75; 36 3.25,4.75; 37 2.75,4.75; 38 2.25,4.75; 39 1.75,4.75; 40 1.25,4.75; 41 0.75,4.75; 42 0.25,4.75; 43 -0.25,4.75; 44 -0.75,4.75; 45 -1.25,4.75; 46 -1.75,4.75; 47 -2.25,4.75; 48 -2.75,4.75; 49 -3.25,4.75; 50 -3.75,4.75; 51 -4.25,4.75; 52 -4.75,4.75; 53 -5.25,4.75; 54 -5.75,4.75; 55 -6.25,4.75; 56 -6.75,4.75 | smd 6.35 x 3.6: 57 0,0
4-SMD = smd 1 x 0.93: 1 -1.1,-0.8; 2 1.1,-0.8; 3 1.1,0.8; 4 -1.1,0.8

### Placement (x,y rotation side)
C1  37.15,10.79 90 bottom
C2  17.78,15.88 0 bottom
C3  12.38,15.88 180 top
C4  17.78,15.88 180 top
C5  12.38,15.88 0 bottom
C6  29.53,9.84 270 bottom
C7  38.1,21.91 0 bottom
C8  38.1,16.83 0 bottom
C9  39.69,21.27 90 top
C10  38.73,14.29 270 top
C11  26.67,12.7 270 top
C12  41.27,67.63 270 top
C13  26.99,30.16 90 top
C14  39.69,28.57 90 top
C15  35.88,12.7 270 top
C16  44.13,63.82 270 top
C17  29.21,30.16 90 top
C18  24.77,12.7 270 top
C19  34.29,29.84 0 top
C20  32.38,40.96 90 bottom
C21  34.29,31.75 0 top
C22  11.11,29.21 270 top
C23  27.94,40.32 0 top
C24  13.02,29.21 270 top
C25  27.94,38.42 0 top
C26  27.94,36.51 0 top
C27  14.92,29.21 270 top
C28  32.38,36.83 90 bottom
C29  10.48,32.38 180 top
C30  27.94,34.61 0 top
C31  4.76,28.26 90 top
C32  5.71,31.43 180 top
C33  3.17,51.44 90 bottom
C34  29.53,51.75 270 top
C35  4.45,51.12 90 top
C36  28.89,46.67 270 top
C37  10.79,53.66 90 top
C38  16.83,53.02 90 top
C39  21.27,55.56 90 top
C40  1.91,51.12 90 top
C41  2.86,45.72 0 bottom
C42  26.99,46.67 270 top
C43  7.3,44.45 270 top
C44  10.16,42.55 0 bottom
C45  34.92,51.75 270 bottom
C46  33.02,51.75 270 bottom
C47  2.86,41.91 0 bottom
C48  7.94,35.56 180 bottom
C49  2.86,43.81 0 bottom
D1  2.54,33.97 90 bottom
D2  11.11,39.05 270 bottom
J1  42.55,36.51 270 top
J2  42.55,19.37 270 top
J3  36.2,3.17 180 top
J4  9.53,3.17 180 top
J5  3.49,15.56 90 top
J6  15.56,80.33 0 top
J7  40.01,93.03 0 top
JP1  22.86,1.91 0 top
L1  28.89,35.56 180 bottom
L2  6.35,37.47 0 top
LED1  37.47,49.21 270 top
LED2  38.42,9.53 270 top
LED3  37.47,47.31 270 top
LED4  38.42,7.3 270 top
LED5  3.17,38.1 0 bottom
LED6  32.38,33.02 180 bottom
Q1  7.62,70.8 180 top
Q2  7.62,68.9 0 bottom
Q3  20,70.8 180 top
Q4  20,68.9 0 bottom
Q5  32.38,70.8 180 top
Q6  32.38,68.9 0 bottom
R1  16.83,6.99 0 top
R2  18.41,9.53 180 top
R3  23.5,8.57 270 top
R4  21.59,8.57 270 top
R5  120R  [R0805']  33.34,5.4 0 bottom
R6  16.51,12.7 90 bottom
R7  11.11,12.7 90 top
R8  16.51,12.7 90 top
R9  11.11,12.7 90 bottom
R10  18.73,12.7 90 bottom
R11  13.34,12.7 90 top
R12  18.73,12.7 90 top
R13  13.34,12.7 270 bottom
R14  7.62,19.37 0 bottom
R15  7.62,17.14 0 bottom
R16  7.62,14.92 0 bottom
R17  7.62,12.7 0 bottom
R18  7.62,10.48 0 bottom
R19  38.1,6.35 270 bottom
R20  40.32,6.35 270 bottom
R21  42.55,6.35 270 bottom
R22  41.27,49.21 180 top
R23  42.23,9.53 180 top
R24  41.27,47.31 180 top
R25  42.23,7.3 180 top
R26  41.27,63.82 270 top
R27  41.27,71.44 270 top
R28  44.13,71.44 270 top
R29  44.13,67.63 270 top
R30  1.27,38.1 270 bottom
R31  33.66,43.5 270 top
R32  33.66,39.69 90 top
R33  35.56,43.5 270 top
R34  35.56,39.69 90 top
R35  37.47,43.5 270 top
R36  37.47,39.69 90 top
R37  7.94,33.66 180 bottom
R38  9.21,30.48 270 bottom
R39  14.29,31.75 0 bottom
R40  28.89,33.02 180 bottom
R41  5.71,33.66 180 top
R42  6.67,28.26 90 top
R43  10.16,45.09 0 bottom
R44  29.84,54.61 0 bottom
R45  29.84,48.9 0 bottom
R46  29.84,52.7 0 bottom
R47  29.84,50.8 0 bottom
R48  24.45,51.75 90 bottom
R49  13.65,51.75 90 bottom
R50  17.46,59.69 180 bottom
R51  9.84,59.69 0 bottom
R52  13.34,58.74 90 bottom
R53  9.84,57.47 0 bottom
R54  21.59,59.69 180 bottom
R55  25.72,59.69 180 bottom
R56  17.46,57.78 180 bottom
R57  32.38,58.42 270 bottom
R58  35.24,58.42 90 bottom
R59  30.48,58.42 90 bottom
U1  33.34,10.79 270 bottom
U2  31.75,21.27 180 top
U3  28.89,39.37 180 bottom
U4  18.1,41.27 0 top
Y1  38.1,19.37 180 bottom

### Tracks (layer width: path | path; a pad name or v marks a point on that pad's centre or on a via)
+3V3  (via drill 0.5)
  Top 0.254: U4.24 22.85,38.41 23.18,38.73 25.4,38.73 25.72,38.42 25.72,37.78 C26.1 26.67,36.51 v26.35,36.2 | C11.1 26.44,13.88 | U2.64 35.5,14.03 C15.1 v36.51,14.29 | U2.13 38.76,23.52 40.01,24.77 40.01,27.31 C14.1 v40.64,27.62 | v26.99,29.84 C13.1 26.99,27.91 U2.32 | U4.9 15.35,33.13 14.92,32.7 11.79,32.7 11.48,32.38 C29.1 10.79,31.75 v10.79,31.43 | U2.19 34.5,28.68 C19.1 C21.1 34.93,33.34 v35.88,33.34 | C11.1 v27.62,13.65 | U2.48 26.12,14.2 C11.1 | U2.1 37.38,16.6 C10.1 v40,15.24 v40.01,15.24 | R26.2 v41.27,62.23 | R8.2 15.29,13.7 v15.24,13.65
  Top 0.305: R9.2 v11.11,14.29
  Bottom 0.254: 26.35,35.88 v26.35,36.2 26.35,34.61 26.67,34.29 29.84,34.29 L1.2 | v26.99,29.84 27.94,30.8 33.02,30.8 33.97,31.75 v33.97,34.92 | v41.27,62.23 37.78,58.74 37.78,55.24 40.96,52.07 40.96,47.62 42.55,46.04 42.55,45.4 v43.18,44.77
  Bottom 0.305: 36.89,9.85 C1.1 35.5,8.2 U1.5
  pour Bottom (rank 2): 36.51,33.02 31.11,33.02 31.11,34.29 28.89,34.29 28.89,39.37 30.8,39.37 30.8,37.47 31.43,36.83 33.34,36.83 33.66,37.15 33.66,43.5 35.56,45.4 46.04,45.4 46.04,-0.32 18.41,-0.32 18.41,10.48 5.4,10.48 5.4,27.62 8.26,30.48 8.26,33.97 12.38,33.97 12.38,33.02 11.75,32.38 11.75,30.8 12.06,30.48 16.51,30.48 29.53,17.46 29.53,9.53 33.66,5.4 36.51,5.4
+5V  (via drill 0.5)
  Top 0.254: R2.2 v16.51,9.53
  Top 0.406: J1.P$1 41.59,43.47 v41.59,45.72 | v26.04,7.94 27.62,7.94 28.57,8.89 28.57,9.53 | 28.57,9.53 v28.57,10.79 | J3.P$7 30.2,7.91 28.57,9.53 | v5.71,37.47 L2.P$2
  Bottom 0.254: U3.3 | C6.1 33.34,10.79 33.97,11.43 U1.3
  Bottom 0.406: U3.3 29.84,42.86 29.53,43.18 28.26,43.18 27.94,42.86 U3.1 27.94,40.01 28.26,39.69 29.21,39.69 | 29.21,39.69 29.53,39.69 | 29.53,39.69 29.84,40.01 U3.3 | C48.1 5.71,35.56 4.45,36.83 5.08,36.83 v5.71,37.47 5.71,46.35 6.35,46.99 13.02,46.99 13.65,46.35 21.27,46.35 22.23,45.4 33.66,45.4 34.29,44.77 34.29,44.45 | v41.59,45.72 40.64,44.77 36.2,44.77 35.88,44.45 34.29,44.45 | v28.57,10.79 C6.1 | v16.51,9.53 18.1,7.94 v26.04,7.94 | 29.21,39.69 | 34.29,44.45 34.29,40.96 33.34,40.01 C20.1 32.06,39.69 29.53,39.69
  pour Bottom (rank 3): 7.94,30.48 7.94,39.05 1.91,39.05 1.91,30.8 -0.32,30.8 -0.32,-0.32 18.41,-0.32 18.41,10.16 5.08,10.16 5.08,27.62
ADC_TEMP  (via drill 0.5)
  Top 0.254: U2.17 36.11,26.9 36.51,27.3 36.51,32.38 38.1,33.97 38.1,35.88 37.47,36.51 32.38,36.51 31.75,37.15 31.75,40.01 32.38,40.64 32.38,45.4 34.61,47.62 v34.92,47.62 | R27.2 C12.1 40.95,68.58 40.01,67.63 40.01,65.09 40.42,64.67 R26.1 41.27,64.45 v39.37,62.55
  Bottom 0.254: v34.92,47.62 36.83,49.53 36.83,54.29 36.51,54.61 36.51,59.69 v39.37,62.55
AN_IN  (via drill 0.5)
  Top 0.254: U2.10 36.08,22.02 34.92,23.18 v34.92,24.77 | v39.37,31.11 40.64,32.38 40.64,40.96 40.96,41.27 40.96,42.55 40.32,43.18 v40.32,45.72 | R28.2 R29.1 42.86,67.36 42.86,65.41 | 42.86,65.41 43.5,64.77 C16.1 | 42.86,65.41 42.86,62.23 41.91,61.28 v39.05,61.28
  Bottom 0.254: v34.92,24.77 34.92,25.08 39.37,29.53 v39.37,31.11 | v39.05,61.28 37.15,59.37 37.15,54.93 40.32,51.75 v40.32,45.72
AUX_1  (via drill 0.5)
  Top 0.254: U2.11 36.53,22.52 35.88,23.18 v35.88,25.08 | J5.P$6 4.25,20.32 13.34,20.32 v15.56,22.54
  Bottom 0.254: v35.88,25.08 35.88,24.45 34.61,23.18 32.38,23.18 27.62,27.94 25.4,27.94 23.81,29.53 20.95,29.53 20.32,30.16 18.73,30.16 15.56,26.99 v15.56,22.54 | J5.P$6 6.43,19.56 R14.2
AUX_2  (via drill 0.5)
  Top 0.254: U2.9 34.67,21.52 v34.29,21.91 | v16.51,22.54 13.65,19.68 5.62,19.68 J5.P$5
  Bottom 0.254: v34.29,21.91 33.02,21.91 27.62,27.3 25.08,27.3 23.5,28.89 20.95,28.89 20.32,29.53 19.05,29.53 18.57,29.05 | 18.57,29.05 18.1,28.57 | J5.P$5 6.21,17.56 R15.2 | 18.57,29.05 16.51,26.99 v16.51,22.54
AUX_3  (via drill 0.5)
  Top 0.254: v30.16,23.5 30,23.66 U2.28 | v17.46,22.54 13.97,19.05 6.99,19.05 J5.P$4
  Bottom 0.254: v30.16,23.5 27.94,26.04 27.3,26.67 24.77,26.67 23.18,28.26 20.64,28.26 20,28.89 19.37,28.89 17.46,26.99 v17.46,22.54 | J5.P$4 5.99,15.56 R16.2
AUX_4  (via drill 0.5)
  Top 0.254: U2.39 28.14,22.02 v28.26,21.91 | v18.41,22.54 14.29,18.41 8.35,18.41 J5.P$3
  Bottom 0.254: v28.26,21.91 27.62,21.91 22.54,26.99 20,26.99 18.41,25.4 v18.41,22.54 | J5.P$3 5.76,13.56 R17.2
AUX_5  (via drill 0.5)
  Top 0.254: U2.40 27.05,21.52 v27.62,20.95 | v19.37,22.54 14.61,17.78 9.71,17.78 J5.P$2
  Bottom 0.254: v27.62,20.95 22.23,26.35 20.32,26.35 19.37,25.4 v19.37,22.54 | J5.P$2 5.54,11.56 R18.2
AUX_6
  Top 0.254: U2.50 28.5,14.36 29.84,13.02 29.84,9.21 34.29,4.76 36.61,4.76 J3.P$3
  Bottom 0.254: R19.2 38.1,3.27 J3.P$3
AUX_7
  Top 0.254: U2.54 30.5,9.51 34.61,5.4 37.97,5.4 J3.P$2
  Bottom 0.254: R20.2 40.32,3.3 J3.P$2
AUX_8
  Top 0.254: U2.55 31,9.96 34.92,6.03 39.34,6.03 J3.P$1
  Bottom 0.254: R21.2 42.55,3.52 J3.P$1
BR_SO1
  Top 0.254: U4.25 23.35,33.8 24.45,32.7 30.16,32.7 30.5,32.37 U2.27
BR_SO2
  Top 0.254: U4.26 23.85,34.26 24.77,33.34 30.16,33.34 31,32.5 31,30.48 | U2.26 31,30.48 | 31,30.48 31,30.59
CAR_CAN_N
  Bottom 0.254: J3.P$5 34.2,5.3 R5.1 34.29,5.97 33.59,6.67 33.59,7.81 U1.6
CAR_CAN_P
  Bottom 0.254: J3.P$6 32.2,5.21 R5.2 32.39,5.97 33.08,6.67 33.08,7.81 U1.7
CAR_CAN_RX  (via drill 0.5)
  Top 0.254: v34.29,10.79 34,11.09 U2.61
  Bottom 0.254: 35.24,12.06 U1.4 35.24,11.75 v34.29,10.79
CAR_CAN_TX  (via drill 0.5)
  Top 0.254: U2.62 34.5,16.93 v34.29,17.14
  Bottom 0.254: U1.1 31.43,14.92 32.7,16.19 33.97,16.19 34.29,16.51 v34.29,17.14
DC_CAL  (via drill 0.5)
  Top 0.254: U4.12 16.85,33.36 v16.51,33.02 | U2.33 26.12,25.63 v26.04,25.72 | v19.68,27.94 18.41,29.21 v18.41,30.8
  Bottom 0.254: v19.68,27.94 20,27.62 22.86,27.62 24.77,25.72 v26.04,25.72 | v16.51,33.02 18.41,31.11 v18.41,30.8
EN_GATE  (via drill 0.5)
  Top 0.254: U4.16 18.85,31.75 19.37,31.23 19.37,30.16 21.59,27.94 21.59,25.72 v21.27,25.4 | 29,20.85 v28.89,20.95 29.53,20.32 29.53,19.37 29,18.84 U2.51
  Bottom 0.254: v28.89,20.95 27.94,20 26.67,20 v21.27,25.4
FAULT  (via drill 0.5)
  Top 0.254: U4.6 13.85,34.48 v13.34,33.97 | v22.54,20.32 21.59,21.27 21.59,23.81 17.14,28.26 v17.14,29.84 | v30.48,19.37 30,18.89 U2.53
  Bottom 0.254: v22.54,20.32 25.08,17.78 28.89,17.78 v30.48,19.37 | v13.34,33.97 13.34,33.34 13.02,33.02 12.38,33.02 11.75,32.38 11.75,30.8 12.06,30.48 16.51,30.48 v17.14,29.84
GND  (via drill 0.5, 0.5 pad 0.25)
  Top 0.254: C13.2 v26.99,31.75 | C17.2 29.21,31.75 | U4.28 v25.4,36.51 | R27.1 v41.27,73.03 | C12.2 v41.27,66.04 | R29.2 v44.13,66.04 | C16.2 v44.13,62.23 | U4.10 15.85,38.71 v16.19,39.05 | U4.8 14.85,38.66 v15.24,39.05 | U2.12 38.89,23.02 C9.2 v41.27,22.22 v41.27,22.23 | U2.18 35,29.61 | 35.24,31.11 v35.56,31.43
  Top 0.305: C9.2 40.33,22.22 | C34.2 29.66,50.35 v32.38,47.62 | 7.62,60.33 7.62,60.01 7.3,59.69 7.3,56.52 v7.62,56.2
  Top 0.406: v14.92,58.74 13.34,60.33 7.62,60.33 | R32.1 v33.66,38.1 | v6.03,52.07 6.03,52.39 5.71,52.7 4.63,52.7 C35.2
  Bottom 0.254: U1.2 32.7,12.06 v33.02,11.75 | R50.1 15.88,59.69 v14.92,58.74 | C1.2 v38.1,11.75 | Y1.4 37.6,18.57 Y1.2 | Y1.2 39.2,21.76 C7.1 | C8.1 v40.32,16.83 | U1.8 31.43,7.94 29.84,6.35 v29.21,6.35 | C6.2 28.89,8.26 v28.89,7.62 | C5.2 v11.43,16.82 v11.43,16.83 | R17.1 v9.53,12.7 | R18.1 v9.53,10.48 | v9.53,13.97 8.62,14.88 R16.1 R15.1 | R14.1 8.62,20.27 7.62,21.27 v6.99,21.27 | Y1.2 40.79,20.17 v41.27,19.68 | D1.A 1.59,33.27 v1.59,33.66 | 1.32,39.1 R30.1 1.46,39.29 C47.2
  Bottom 0.305: R38.2 v9.21,28.57 | C4.2 v15.24,15.88
  Bottom 0.406: R48.BL 23.11,47.31 32.07,47.31 v32.38,47.62 | U3.2 v28.89,42.23 | v30.8,37.78 C28.2 33.34,37.78 v33.66,38.1 | v7.94,52.07 v6.03,52.07 6.35,52.39 6.35,55.56 6.99,56.2 v7.62,56.2 | v43.81,5.71 43.81,6.08 R21.1 R20.1 R19.1 | C33.2 5.13,54.03 v5.4,54.29 | v10.16,51.12 10.35,50.92 R49.BL
  other vias: 42.23,51.75 42.23,52.7 42.23,53.66 41.27,53.66 43.18,53.66 44.13,53.66 44.13,52.7 44.13,51.75 43.18,51.75 43.18,52.7 43.18,54.61 44.13,55.56 44.13,54.61 21.91,42.55 21.91,41.59 21.91,40.64 21.91,39.69 20.95,39.05 20,39.05 19.05,39.05 18.1,39.05 17.14,39.05 14.29,39.69 14.29,40.64 14.29,41.59 15.88,43.5 16.83,43.5 17.78,43.5 18.73,43.5 19.68,43.5 20.64,43.5 22.86,42.23 22.86,41.27 22.86,40.32 13.34,40.01 13.34,40.96 13.34,39.05 1.46,41.91 1.46,43.81 1.46,45.72
  pour Top (rank 6): -0.64,85.09 46.99,85.09 46.99,-1.91 -0.64,-1.91
  pour Bottom (rank 2): 35.88,84.45 46.35,84.45 46.35,50.16 41.27,50.16 38.1,53.66 38.1,78.11 35.88,78.11
  pour Bottom (rank 5): 6.35,46.67 12.7,46.67 13.34,46.04 21.27,46.04 22.23,45.09 33.97,45.09 33.97,40.32 27.3,40.32 27.3,34.61 28.89,34.61 28.89,33.02 29.21,32.7 36.2,32.7 36.2,28.57 32.7,25.08 30.16,25.08 26.99,28.26 25.4,28.26 24.13,29.53 24.13,29.84 23.81,30.16 17.46,30.16 13.34,34.29 9.84,34.29 5.4,38.73 5.4,45.72
H1
  Top 0.254: U2.43 24.11,20.02 22.23,21.91 22.23,28.26 20,30.48 20,31.43 19.37,32.07 19.37,36.51 U4.17
H1_LOW  (via drill 0.5)
  Top 0.254: U4.44 17.35,49.96 16.51,50.8 15.24,50.8 14.29,51.75 14.29,56.2 v15.88,57.78
  Bottom 0.254: R56.1 v15.88,57.78
  Bottom 0.406: R56.1 16.51,57.74 16.51,56.83 15.88,56.2 14.29,56.2 12.32,54.23 R49.BR 9.46,54.23 8.89,53.66 8.89,57.42 R53.2 | 5.08,61.28 5.08,62.31 4.96,62.43 Q2.A2 5.08,60.33 7.94,57.47 R53.2 | 8.84,57.52 R53.2
H1_VS  (via drill 0.5)
  Top 0.254: U4.46 16.35,49.06 15.88,49.53 15.24,49.53 13.02,51.75 13.02,56.52 12.38,57.15 11.11,57.15 10.79,56.83 | C37.2 9.84,54.61 9.21,53.98 v9.21,52.39 | v34.29,46.04 34.61,46.35 35.88,46.35 37.47,44.77 R35.1
  Top 0.406: C37.2 10.79,56.83 v8.26,59.37
  Bottom 0.254: v34.29,46.04 22.54,46.04 21.59,46.99 13.97,46.99 13.34,47.62 6.99,47.62 6.35,48.26 6.35,50.48 6.99,51.12 8.57,51.12 9.21,51.75 v9.21,52.39
  Bottom 0.406: v8.26,59.37 7.62,60.01 Q2.K
  other vias: 3.49,76.2 3.49,75.25 6.67,76.2 5.08,74.3 6.03,74.3 4.13,74.3 4.13,73.34 5.08,73.34 6.03,73.34 6.67,75.25
  pour Top (rank 2): 15.24,84.14 15.24,79.69 14.61,79.06 8.26,79.06 6.99,77.79 6.99,73.34 6.35,72.71 3.81,72.71 3.17,73.34 3.17,81.28 6.03,84.14
  pour Bottom: 2.54,77.79 12.7,77.79 12.7,68.9 2.54,68.9
H2  (via drill 0.5)
  Top 0.254: U4.19 20.35,32.67 v20.64,32.38 | U2.42 24.56,20.52 22.86,22.23 22.86,28.89 v21.27,30.48
  Bottom 0.254: v21.27,30.48 21.27,31.75 v20.64,32.38
H2_LOW  (via drill 0.5)
  Top 0.254: U4.39 v19.85,57.31
  Bottom 0.254: R56.2 19.38,57.78 v19.85,57.31
  Bottom 0.406: R56.2 R50.2 17.46,60.69 Q4.A2
H2_VS  (via drill 0.5)
  Top 0.254: C38.2 15.24,52.38 v15.24,51.75 | 16.83,57.15 18.1,57.15 18.85,56.4 U4.41 | R33.1 v35.56,45.4
  Top 0.406: C38.2 16.83,57.15 16.83,58.1 v14.92,60.01
  Bottom 0.254: v15.24,51.75 13.97,50.48 13.97,47.94 14.29,47.62 21.91,47.62 22.86,46.67 33.66,46.67 33.97,46.99 34.61,46.99 35.56,46.04 v35.56,45.4 35.56,45.72
  Bottom 0.406: 20,71.75 Q4.K 17.77,71.12 15.56,71.12 15.56,61.59 14.92,60.96 v14.92,60.01
  other vias: 15.88,76.2 15.88,75.25 19.05,76.2 19.05,75.25 17.46,74.3 18.41,74.3 18.41,73.34 17.46,73.34 16.51,73.34 16.51,74.3
  pour Top: 15.56,84.14 15.56,73.34 16.19,72.71 18.73,72.71 19.37,73.34 19.37,84.14
  pour Bottom: 14.92,77.79 25.08,77.79 25.08,68.9 14.92,68.9
H3  (via drill 0.5)
  Top 0.254: U4.21 21.35,33.58 v21.59,33.34 | v22.54,30.48 23.5,29.53 23.5,23.5 | U2.41 25.02,21.02 23.5,22.54 23.5,23.5 | 23.5,23.5 23.5,22.86
  Bottom 0.254: v22.54,30.48 22.54,32.38 v21.59,33.34
H3_LOW  (via drill 0.5)
  Top 0.254: U4.34 22.35,49.97 25.08,52.7 25.08,55.88 28.57,59.37 v29.21,59.37
  Bottom 0.254: 30.21,59.42 29.26,59.42 v29.21,59.37
  Bottom 0.406: Q6.A2 29.84,60.05 R59.2 30.21,59.42 27.62,56.83 23.5,56.83 23.18,57.15 22.54,57.15 21.27,55.88 21.27,54.36 R48.BR
H3_VS  (via drill 0.5)
  Top 0.254: v21.59,57.47 23.18,57.47 23.81,56.83 23.81,53.34 21.35,50.88 U4.36 21.35,44.06 21.91,43.5 v22.23,43.5 | v33.34,43.81 33.34,44.18 R31.1
  Top 0.406: C39.2 21.27,57.15 v21.59,57.47
  Bottom 0.254: v22.23,43.5 23.5,44.77 32.7,44.77 33.34,44.13 v33.34,43.81
  Bottom 0.406: v21.59,57.47 21.91,57.78 27.3,57.78 28.26,58.74 28.26,69.53 28.89,70.17 29.2,70.17 Q6.K 32.38,70.48
  other vias: 28.26,76.52 31.43,76.52 31.43,75.56 29.84,74.3 28.26,75.56 28.89,74.3 30.8,74.3 30.8,73.34 29.84,73.34 28.89,73.34
  pour Top (rank 2): 19.68,84.14 19.68,79.69 20.32,79.06 26.67,79.06 27.94,77.79 27.94,73.34 28.57,72.71 31.11,72.71 31.75,73.34 31.75,81.28 28.89,84.14
  pour Bottom: 27.3,77.79 37.47,77.79 37.47,68.9 27.3,68.9
HALL_1_IN
  Bottom 0.254: R10.1 R6.1 9.53,4.71 J4.P$4 9.57,3.17
HALL_1_OUT  (via drill 0.5)
  Top 0.254: U2.59 33,16.81 v33.34,17.14 | v18.41,18.1 20,18.1 v21.27,16.83
  Bottom 0.254: v33.34,17.14 32.38,18.1 31.75,18.1 30.16,16.51 21.59,16.51 v21.27,16.83 | C2.1 | C2.1 R10.2 | 19.36,16.51 C2.1 | v18.41,18.1 18.41,16.19 C2.1
HALL_2_IN
  Top 0.254: R7.1 R11.1 13.02,11.38 13.02,4.67 J4.P$3
HALL_2_OUT  (via drill 0.5)
  Top 0.254: U2.58 32.5,16.71 v32.07,17.14 | R11.2 C3.1 14.6,17.14 20,17.14 21.27,15.88 v21.27,15.56
  Bottom 0.254: v32.07,17.14 30.8,15.88 21.59,15.88 v21.27,15.56
HALL_3_IN
  Top 0.254: R12.1 R8.1 13.53,8.71 J4.P$2
HALL_3_OUT  (via drill 0.5)
  Top 0.254: U2.52 29.5,14.63 v29.84,14.29 | 18.73,14.29 R12.2 | 18.73,14.29 C4.1 | v21.27,14.29 18.73,14.29
  Bottom 0.254: v29.84,14.29 28.89,15.24 22.23,15.24 v21.27,14.29
L1
  Top 0.254: U4.18 19.85,32.22 20.64,31.43 22.54,31.43 24.13,29.84 24.13,24.13 24.74,23.52 U2.36
L2
  Top 0.254: U4.20 20.85,33.13 21.59,32.38 22.54,32.38 24.77,30.16 24.77,24.45 25.19,24.02 U2.35
L3
  Top 0.254: U2.34 27.06,24.52 27.3,24.77 27.3,26.35 25.4,28.26 25.4,30.48 21.85,34.03 U4.22
LED_GREEN_1  (via drill 0.5)
  Top 0.254: v32.07,24.45 32,24.52 U2.24 32,32.95 32.38,33.34 34.29,33.34 35.24,34.29 v37.15,34.29 | v40.01,41.59 40.01,42.23 39.69,42.55 39.69,45.4 38.73,46.35 37.78,46.35 37.47,46.67 37.47,48.16 LED1.A
  Bottom 0.254: 37.47,34.29 v37.15,34.29 40.01,37.15 v40.01,41.59
LED_GREEN_2
  Top 0.254: U2.57 32,10.86 33.66,9.21 37.05,9.21 LED2.A
LED_RED_1  (via drill 0.5)
  Top 0.254: v31.11,25.4 31.5,25.79 U2.25 31.5,33.41 32.07,33.97 34.29,33.97 35.88,35.56 v37.15,35.56 | v39.05,41.59 39.05,45.4 38.73,45.72 37.47,45.72 36.41,46.77 LED3.A
  Bottom 0.254: v37.15,35.56 39.05,37.47 v39.05,41.59
LED_RED_2
  Top 0.254: LED4.A 34.61,7.3 31.5,10.41 U2.56
M_H1  (via drill 0.5)
  Top 0.254: U4.47 15.85,48.6 15.56,48.9 14.92,48.9 12.38,51.44 12.38,55.88 v12.06,56.2
  Bottom 0.254: 12.11,56.2 v12.06,56.2 12.06,56.47 R52.1
M_H2  (via drill 0.5)
  Top 0.254: v17.78,56.2 18.35,55.63 U4.42
  Bottom 0.254: v17.78,56.2 20,56.2 20.64,56.83 20.64,57.78 21.27,58.42 23.45,58.42 R55.1
M_H3  (via drill 0.5)
  Top 0.254: U4.37 20.85,51.33 22.86,53.34 v22.86,56.2
  Bottom 0.254: v22.86,56.2 33.34,56.2 34.56,57.42 R58.1
M_L1  (via drill 0.5)
  Top 0.254: U4.45 16.85,49.51 16.19,50.16 15.24,50.16 13.65,51.75 13.65,57.47 v11.75,59.37
  Bottom 0.254: R51.1 11.16,59.37 v11.75,59.37
M_L2  (via drill 0.5)
  Top 0.254: U4.40 19.37,46.05 19.37,56.52 19.05,56.83 19.05,58.74 v20,59.69
  Bottom 0.254: v20,59.69 R54.1
M_L3  (via drill 0.5)
  Top 0.254: U4.35 21.85,50.42 24.45,53.02 24.45,56.2 28.57,60.33 32.07,60.33 | 32.07,60.33 v32.38,60.01 32.07,60.33
  Bottom 0.254: v32.38,60.01 R57.1
MISO_ADC_EXT2  (via drill 0.5)
  Top 0.254: U2.22 33,27.96 v32.7,28.26
  Bottom 0.254: v32.7,28.26 32.7,28.57 33.34,29.21 35.24,29.21 36.51,30.48 36.51,32.38 42.55,38.42 J1.P$3
N$1
  Top 0.254: LED3.C R24.2
N$2
  Top 0.254: LED2.C R23.2
N$3
  Top 0.254: JP1.P$2 22.21,6.95 R4.2
N$4
  Top 0.254: JP1.P$3 22.86,6.94 R3.2
N$5
  Top 0.254: JP1.P$1 21.59,4.79 21.59,5.4 20.32,6.67 20.32,8.62 R2.1
N$6
  Top 0.254: U2.47 25.01,18.02 24.45,17.46 24.45,13.97 C18.1
N$7  (via drill 0.5)
  Top 0.254: 40.43,18.52 v40.64,18.73 | U2.5 36.35,19.52 v35.88,19.05
  Bottom 0.254: v40.64,18.73 39.37,18.73 Y1.3 | 39.05,18.42 Y1.3 | Y1.3 38.89,18.57 C8.2 35.88,18.1 v35.88,19.05
N$8  (via drill 0.5)
  Top 0.254: U2.6 35.58,20.02 v35.56,20
  Bottom 0.254: Y1.1 37.15,20.32 C7.2 35.56,20.32 v35.56,20
N$9
  Top 0.254: U4.1 11.35,35.48 10.16,34.29 7.35,34.29 R41.1
N$10
  Top 0.254: R42.1 6.62,27.31 C31.1
N$11
  Bottom 0.254: U3.5 L1.1
N$12
  Top 0.254: U4.2 11.85,34.39 11.11,33.66 8.57,33.66 8.26,33.34 8.26,32.07 7.94,31.75 6.98,31.75 C32.1 | C32.1 6.99,31.43 | C32.1 R42.2
N$13  (via drill 0.5)
  Top 0.254: U4.3 12.35,34.01 v12.38,33.97
  Bottom 0.254: 9.26,33.34 R37.2 | v12.38,33.97 9.26,33.97 R37.2 | R37.2 9.21,33.38 R38.1
N$14  (via drill 0.5)
  Top 0.254: U4.7 14.35,33.72 v14.29,33.66
  Bottom 0.254: v14.29,33.66 14.29,32.75 R39.2
N$15  (via drill 0.5)
  Top 0.254: C25.1 26.99,39.05 | C25.1 C23.1 | U4.11 16.35,34.13 v16.19,33.97 | C25.1 26.35,38.42 25.4,39.37 v22.86,39.37 22.35,38.86 U4.23
  Bottom 0.254: 16.83,33.97 v16.19,33.97 | 16.83,33.97 17.46,33.97 | v22.86,39.37 22.86,35.88 20.95,33.97 16.83,33.97
N$16
  Top 0.254: C24.1 C22.1 | C24.1 13.02,30.8 | U4.13 17.35,32.59 16.83,32.07 13.65,32.07 13.02,31.43 C24.1
N$17
  Top 0.254: U4.14 17.85,32.45 16.83,31.43 15.24,31.43 14.92,31.11 C27.1
N$18
  Top 0.254: U4.27 24.35,34.39 24.45,34.29 26.67,34.29 C30.1
N$19
  Top 0.254: U4.15 18.35,32 17.14,30.8 16.51,30.8 16.19,30.48 16.19,28.57 15.88,28.26 C27.2
N$20  (via drill 0.5)
  Top 0.305: U4.52 13.35,43.83 v13.02,43.5
  Bottom 0.406: v13.02,43.5 12.06,43.5 C44.1
N$21  (via drill 0.5)
  Top 0.305: v13.02,42.55 13.34,42.55 13.85,43.06 U4.51 U4.50
  Bottom 0.406: C44.2 9.21,42.38 | v13.02,42.55 13.02,41.91 11.58,40.47 D2.C | C44.2 8.89,42.23 | D2.C 9.21,42.38 | 9.21,42.38 C44.2 | D2.C 11.11,40.03 L2.P$1
  other vias: 8.55,37.47
N$22  (via drill 0.5)
  Top 0.305: U4.49 14.85,43.74 v14.61,43.5
  Bottom 0.305: v14.61,43.5 13.02,45.09 R43.1
N$23
  Top 0.254: U4.48 15.35,48.15 15.24,48.26 14.61,48.26 10.79,52.07 C37.1
N$24  (via drill 0.5)
  Top 0.254: U4.33 22.85,49.52 25.72,52.39 25.72,55.24 27.3,56.83 32.7,56.83 v33.97,55.56
  Bottom 0.254: 30.84,54.66 R44.1 30.84,54.98 31.43,55.56 v33.97,55.56
  Bottom 0.406: 34.92,53.02 C45.1 33.02,54.61 R44.1
N$25
  Top 0.254: 17.14,52.07 C38.1 17.85,51.05 U4.43
N$26  (via drill 0.5)
  Top 0.254: U4.32 23.35,49.06 26.35,52.07 26.35,54.93 27.62,56.2 31.43,56.2 33.02,54.61 v34.29,54.61
  Bottom 0.254: C45.2 35.56,50.8 36.2,51.44 36.2,53.98 35.56,54.61 v34.29,54.61
  Bottom 0.406: 34.92,50.48 C45.2 34.92,49.85 33.97,48.9 R45.1
N$27
  Top 0.254: U4.38 20.35,53.69 C39.1
N$28  (via drill 0.5)
  Top 0.254: U4.30 24.35,48.16 27.62,51.44 27.62,54.29 28.26,54.93 30.8,54.93 31.75,53.98 v31.75,51.12
  Bottom 0.406: R47.1 31.16,51.12 v31.75,51.12 32.07,50.8 C46.2
N$29  (via drill 0.5)
  Top 0.254: U4.31 23.85,48.61 26.99,51.75 26.99,54.61 27.94,55.56 31.11,55.56 32.7,53.98 v32.7,53.66
  Bottom 0.406: R46.1 C46.1 32.7,53.02 v32.7,53.66
N$30  (via drill 0.5)
  Top 0.254: 10.36,76.95 Q1.A1
  Top 0.406: 9.84,76.2 9.84,77.79 10.16,77.47 Q1.A1 10.36,76.95 v13.65,73.66
  Bottom 0.406: R52.2 13.65,60.05 v13.65,73.66
N$31  (via drill 0.5)
  Top 0.254: 22.74,76.95 Q3.A1
  Top 0.406: 22.54,75.88 Q3.A1 22.74,76.95 v26.04,73.66
  Bottom 0.406: R55.2 26.04,60.37 v26.04,73.66
N$32  (via drill 0.5)
  Top 0.406: Q5.A1 37.9,73.98 v38.1,73.98
  Bottom 0.406: R58.2 35.29,59.42 38.1,62.23 v38.1,73.98
N$33
  Bottom 0.406: R53.1 10.84,57.69 R51.2 10.16,61.01 Q2.A1
N$34
  Bottom 0.406: R54.2 22.59,62.7 Q4.A1
N$35
  Bottom 0.406: R59.1 R57.2 32.97,57.42 33.66,58.1 33.66,61.48 Q6.A1
N$36
  Top 0.254: 74.61,119.38 74.61,119.06
N$37
  Top 0.254: U2.31 28.5,28.5 C17.1
N$38
  Top 0.254: LED1.C R22.2
N$39
  Top 0.254: R25.2 LED4.C
N$40
  Bottom 0.254: 3.49,39.47 LED5.C 1.27,37.24 R30.2
N$81
  Bottom 0.254: LED6.C 30.94,31.97 R40.2
NRST
  Top 0.254: U2.7 39.49,20.52 C9.1 40.73,21.37 J2.P$3
RX_SCL_MOSI  (via drill 0.5)
  Top 0.254: U2.29 29.5,23.2 30.16,22.54 | 30.16,22.54 31.11,22.54 v33.02,24.45 32.5,24.97 U2.23 | U2.38 27.6,22.52 27.94,22.86 29.84,22.86 30.16,22.54
  Bottom 0.254: v33.02,24.45 33.02,25.08 37.78,29.84 37.78,31.75 40.55,34.51 J1.P$5
SCK_ADC_EXT  (via drill 0.5)
  Top 0.254: U2.21 33.5,28.09 v33.66,28.26
  Bottom 0.254: v33.66,28.26 35.24,28.26 37.15,30.16 37.15,32.07 41.59,36.51 J1.P$4
SENS1
  Top 0.254: 37.41,25.02 U2.16 37.15,25.25 37.15,32.07 38.73,33.66 38.73,36.2 37.78,37.15 32.7,37.15 32.38,37.47 32.38,39.69 33.38,40.69 R32.2 R31.2
SENS2
  Top 0.254: U2.15 38.49,24.52 38.73,24.77 38.73,25.4 37.78,26.35 37.78,31.75 39.37,33.34 39.37,34.92 39.37,35.24 39.37,39.05 38.73,39.69 35.88,39.69 35.56,40.01 R34.2 R33.2
SENS3
  Top 0.254: U2.14 38.63,24.02 39.37,24.77 39.37,25.4 38.42,26.35 38.42,31.43 40.01,33.02 40.01,39.37 38.73,40.64 37.51,40.64 R36.2 R35.2
SGND
  pour Top: 25.4,6.03 26.35,6.03 27.94,4.45 27.94,-0.32 17.78,-0.32 17.78,6.03 20.64,6.03 21.27,5.4 21.27,3.81 24.45,3.81 24.45,5.08
  pour Top: 16.83,8.26 16.83,8.57 20.64,8.57 20.64,5.71 16.83,5.71
SH1_A
  Bottom 0.406: R44.2 26.66,54.61 R48.TR
SH1_B
  Bottom 0.406: R48.TL 28.47,49.27 R45.2
SH2_A
  Bottom 0.406: R49.TR 15.49,53.73 16.83,52.39 28.53,52.39 R46.2
SH2_B
  Bottom 0.406: 15.49,50.09 R49.TL 15.49,49.78 16.83,51.12 28.53,51.12 R47.2
SWCLK  (via drill 0.5)
  Top 0.254: U2.49 28,18.48 v28.26,18.73
  Bottom 0.254: J2.P$2 36.07,23.37 35.88,23.18 35.88,21.27 34.92,20.32 30.16,20.32 29.53,19.68 29.53,19.37 28.89,18.73 v28.26,18.73
SWDIO  (via drill 0.5)
  Top 0.254: U2.46 27.09,18.52 27.3,18.73 27.3,19.05 27.94,19.68 v28.57,19.68
  Bottom 0.254: J2.P$1 37.43,25.37 35.24,23.18 35.24,21.27 34.92,20.95 29.84,20.95 v28.57,19.68
TEMP_IN
  Bottom 0.254: R9.1 R13.2 13.34,9.53 7.53,3.71 J4.P$5
TEMP_MOTOR  (via drill 0.5)
  Top 0.254: U2.8 33.41,21.02 v30.8,18.41 | v16.19,18.1 17.14,19.05 20.32,19.05 v21.27,18.1
  Bottom 0.254: v30.8,18.41 30.48,18.41 29.21,17.14 22.23,17.14 v21.27,18.1 | R13.1 C5.1 13.34,16.51 14.92,18.1 v16.19,18.1
TX_SDA_NSS  (via drill 0.5)
  Top 0.254: U2.37 27.15,23.02 27.94,23.81 v28.26,23.81 29,24.55 U2.30 | v29.53,21.91 31.75,21.91 v33.97,24.13 34,24.16 U2.20
  Bottom 0.254: v28.26,23.81 29.53,22.54 v29.53,21.91 | v33.97,24.13 33.97,25.08 38.42,29.53 38.42,31.43 39.5,32.51 J1.P$6
USB_DM
  Top 0.254: U2.44 22.7,19.52 22.23,19.05 22.23,10.21 R4.1
USB_DP
  Top 0.254: U2.45 23.15,19.02 22.86,18.73 22.86,10.21 R3.1
VCC  (via drill 0.5)
  Top 0.254: U4.54 U4.53
  Top 0.305: U4.53 12.7,46.17 12.7,47.94 12.38,48.26 8.52,48.26 C43.1 | U4.29 26.89,48.07 C42.1 28.26,48.07 | 28.26,48.07 C36.1 | 32.7,60.96 33.34,60.33 33.34,57.47 35.24,55.56 35.24,54.29 32.7,51.75 32.7,50.8 32.07,50.16 31.43,50.16 30.8,50.8 30.8,51.88 C34.1 29.53,53.02 28.26,51.75 28.26,48.07
  Top 0.406: 32.38,63.5 Q5.K 32.38,61.28 32.7,60.96 33.34,60.96 | Q1.K 7.62,61.59 7.3,61.28 6.67,61.28 6.67,55.56 6.99,55.24 6.99,51.44 5.4,49.85 4.58,49.85 C35.1 C40.1 1.91,48.9 v3.17,47.62 6.72,47.62 C43.1
  Bottom 0.406: C47.1 C49.1 C41.1 4.26,46.54 v3.17,47.62 C33.1
  pour Top (rank 4): 40.01,83.5 46.67,83.5 46.04,82.87 46.04,72.71 42.86,72.71 42.86,73.66 40.64,73.66 40.32,73.34 40.32,63.5 37.15,60.64 -0.32,60.64 -0.32,71.44 33.02,71.44 36.2,74.61 36.2,76.52 40.01,80.33

### Text on the board
tPlace: Brandon Valley | BLDC-PCB V1.0